# EAGLE design PT_2015_PB_MAIN_Rev2 (EAGLE 7.0.0)
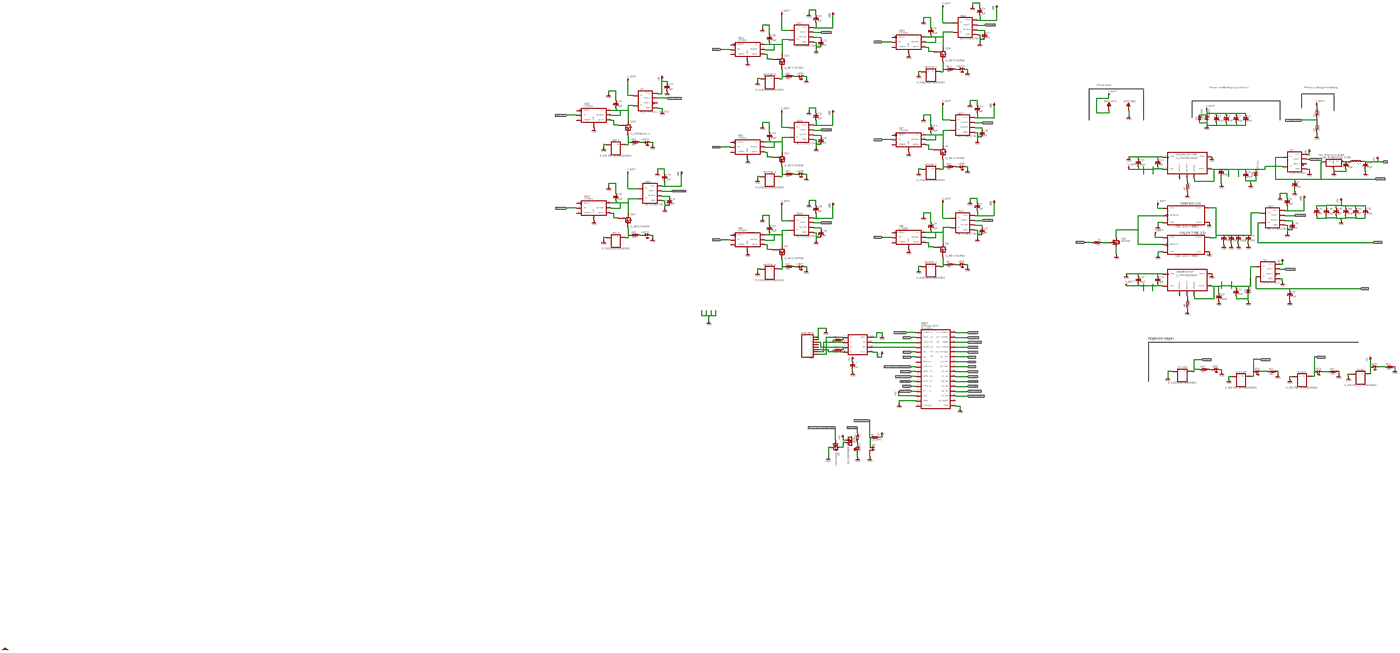
[diagram p0: schematic, sheet 1, overview]
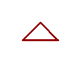
[diagram p1: schematic, sheet 1, part 1 of 5]
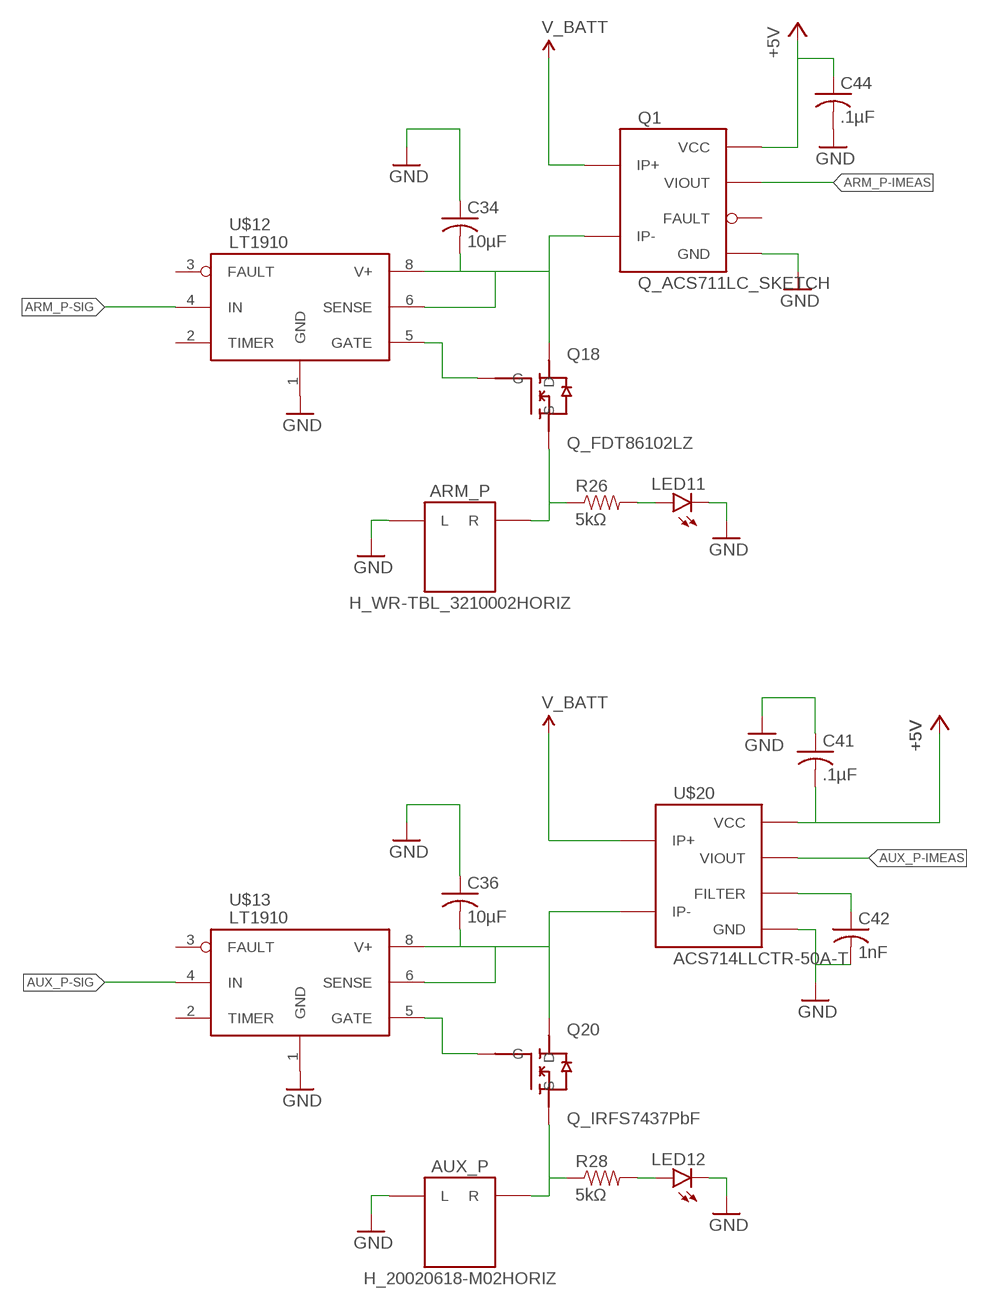
[diagram p2: schematic, sheet 1, part 2 of 5]
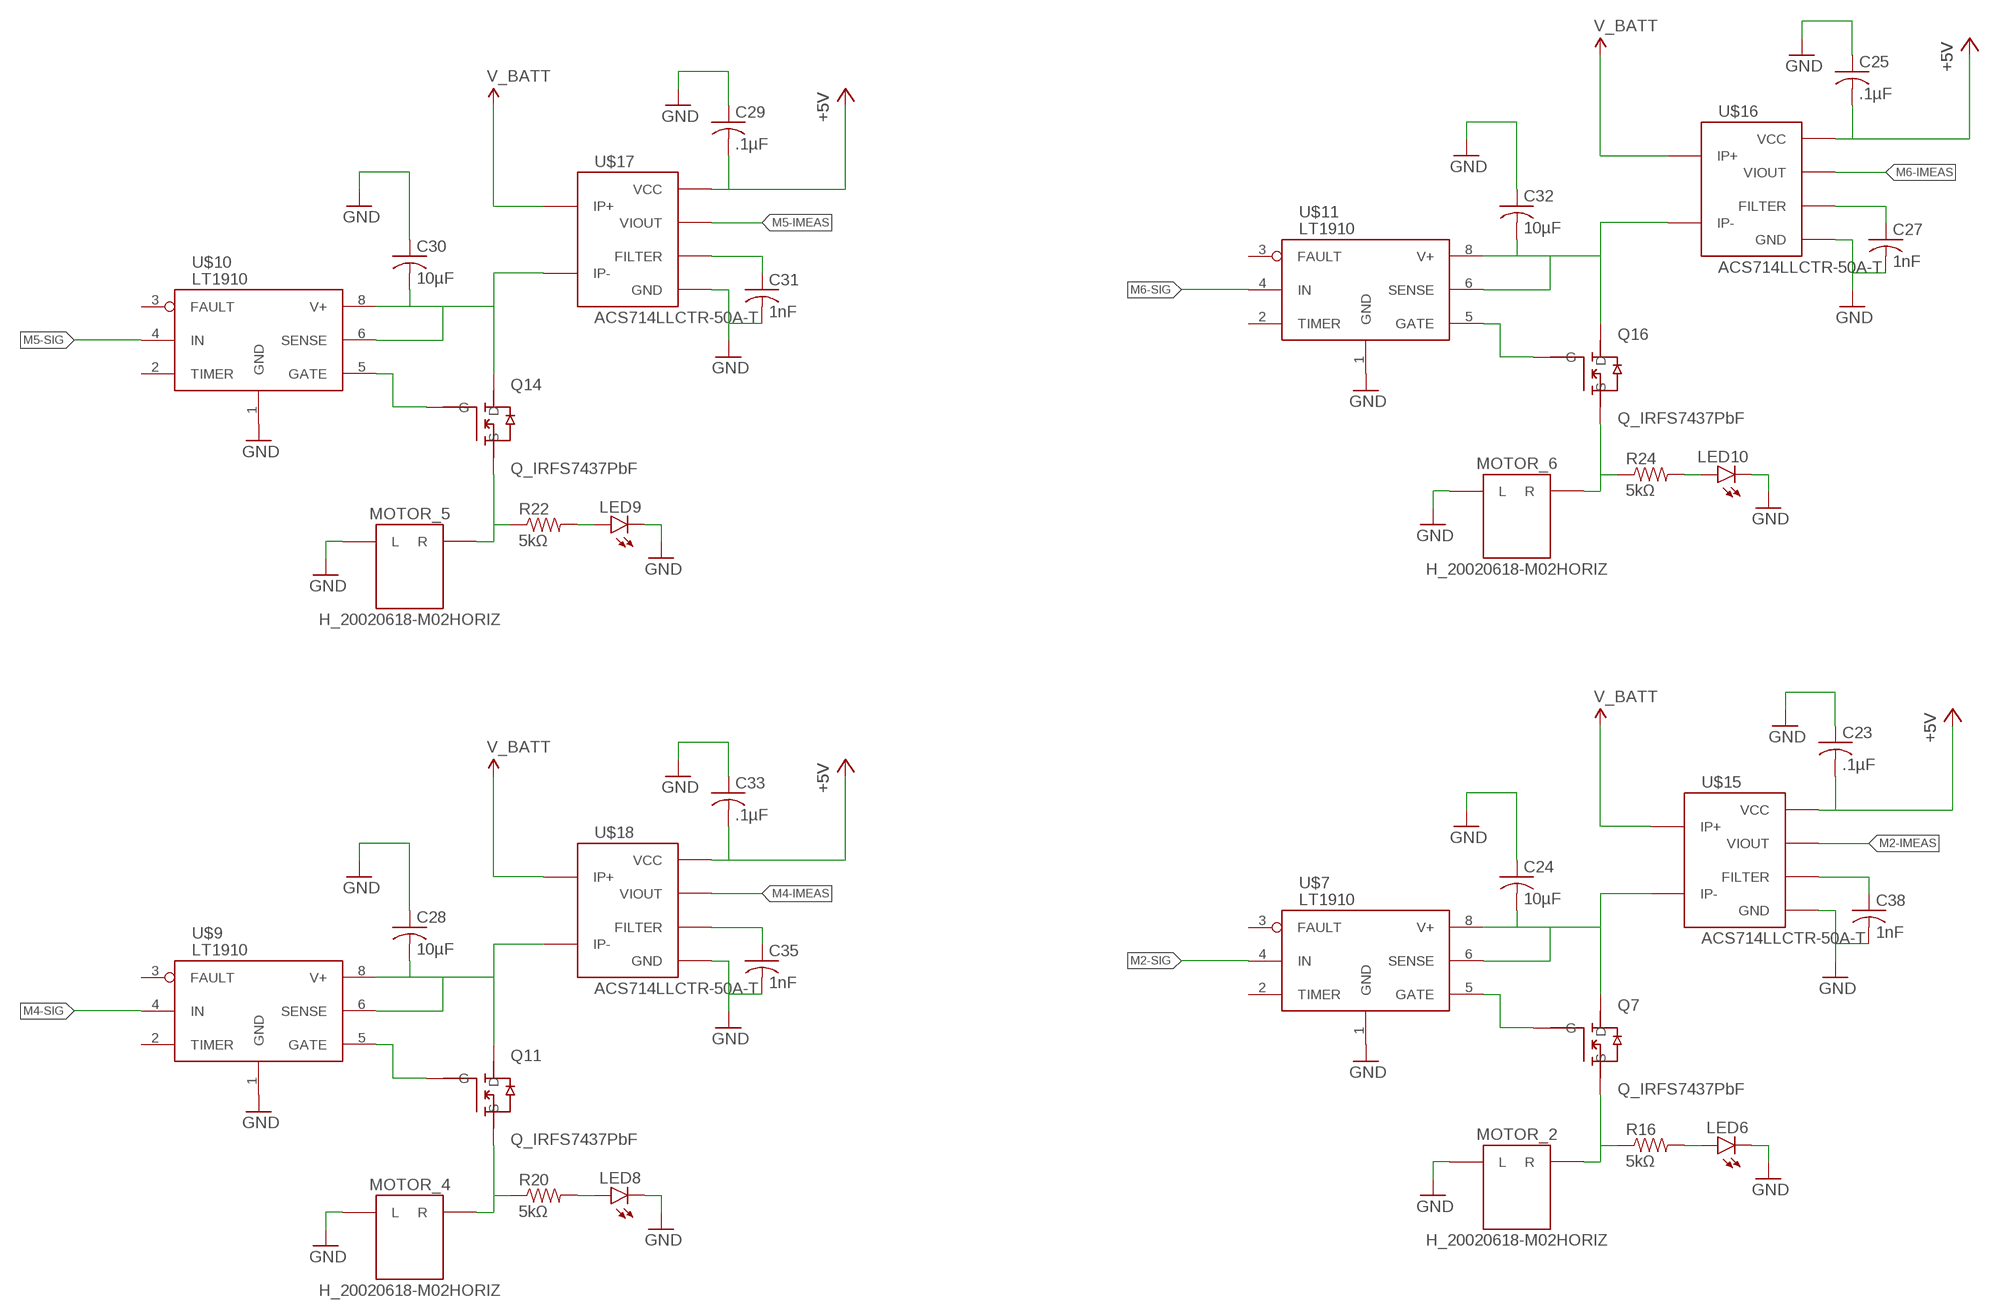
[diagram p3: schematic, sheet 1, part 3 of 5]
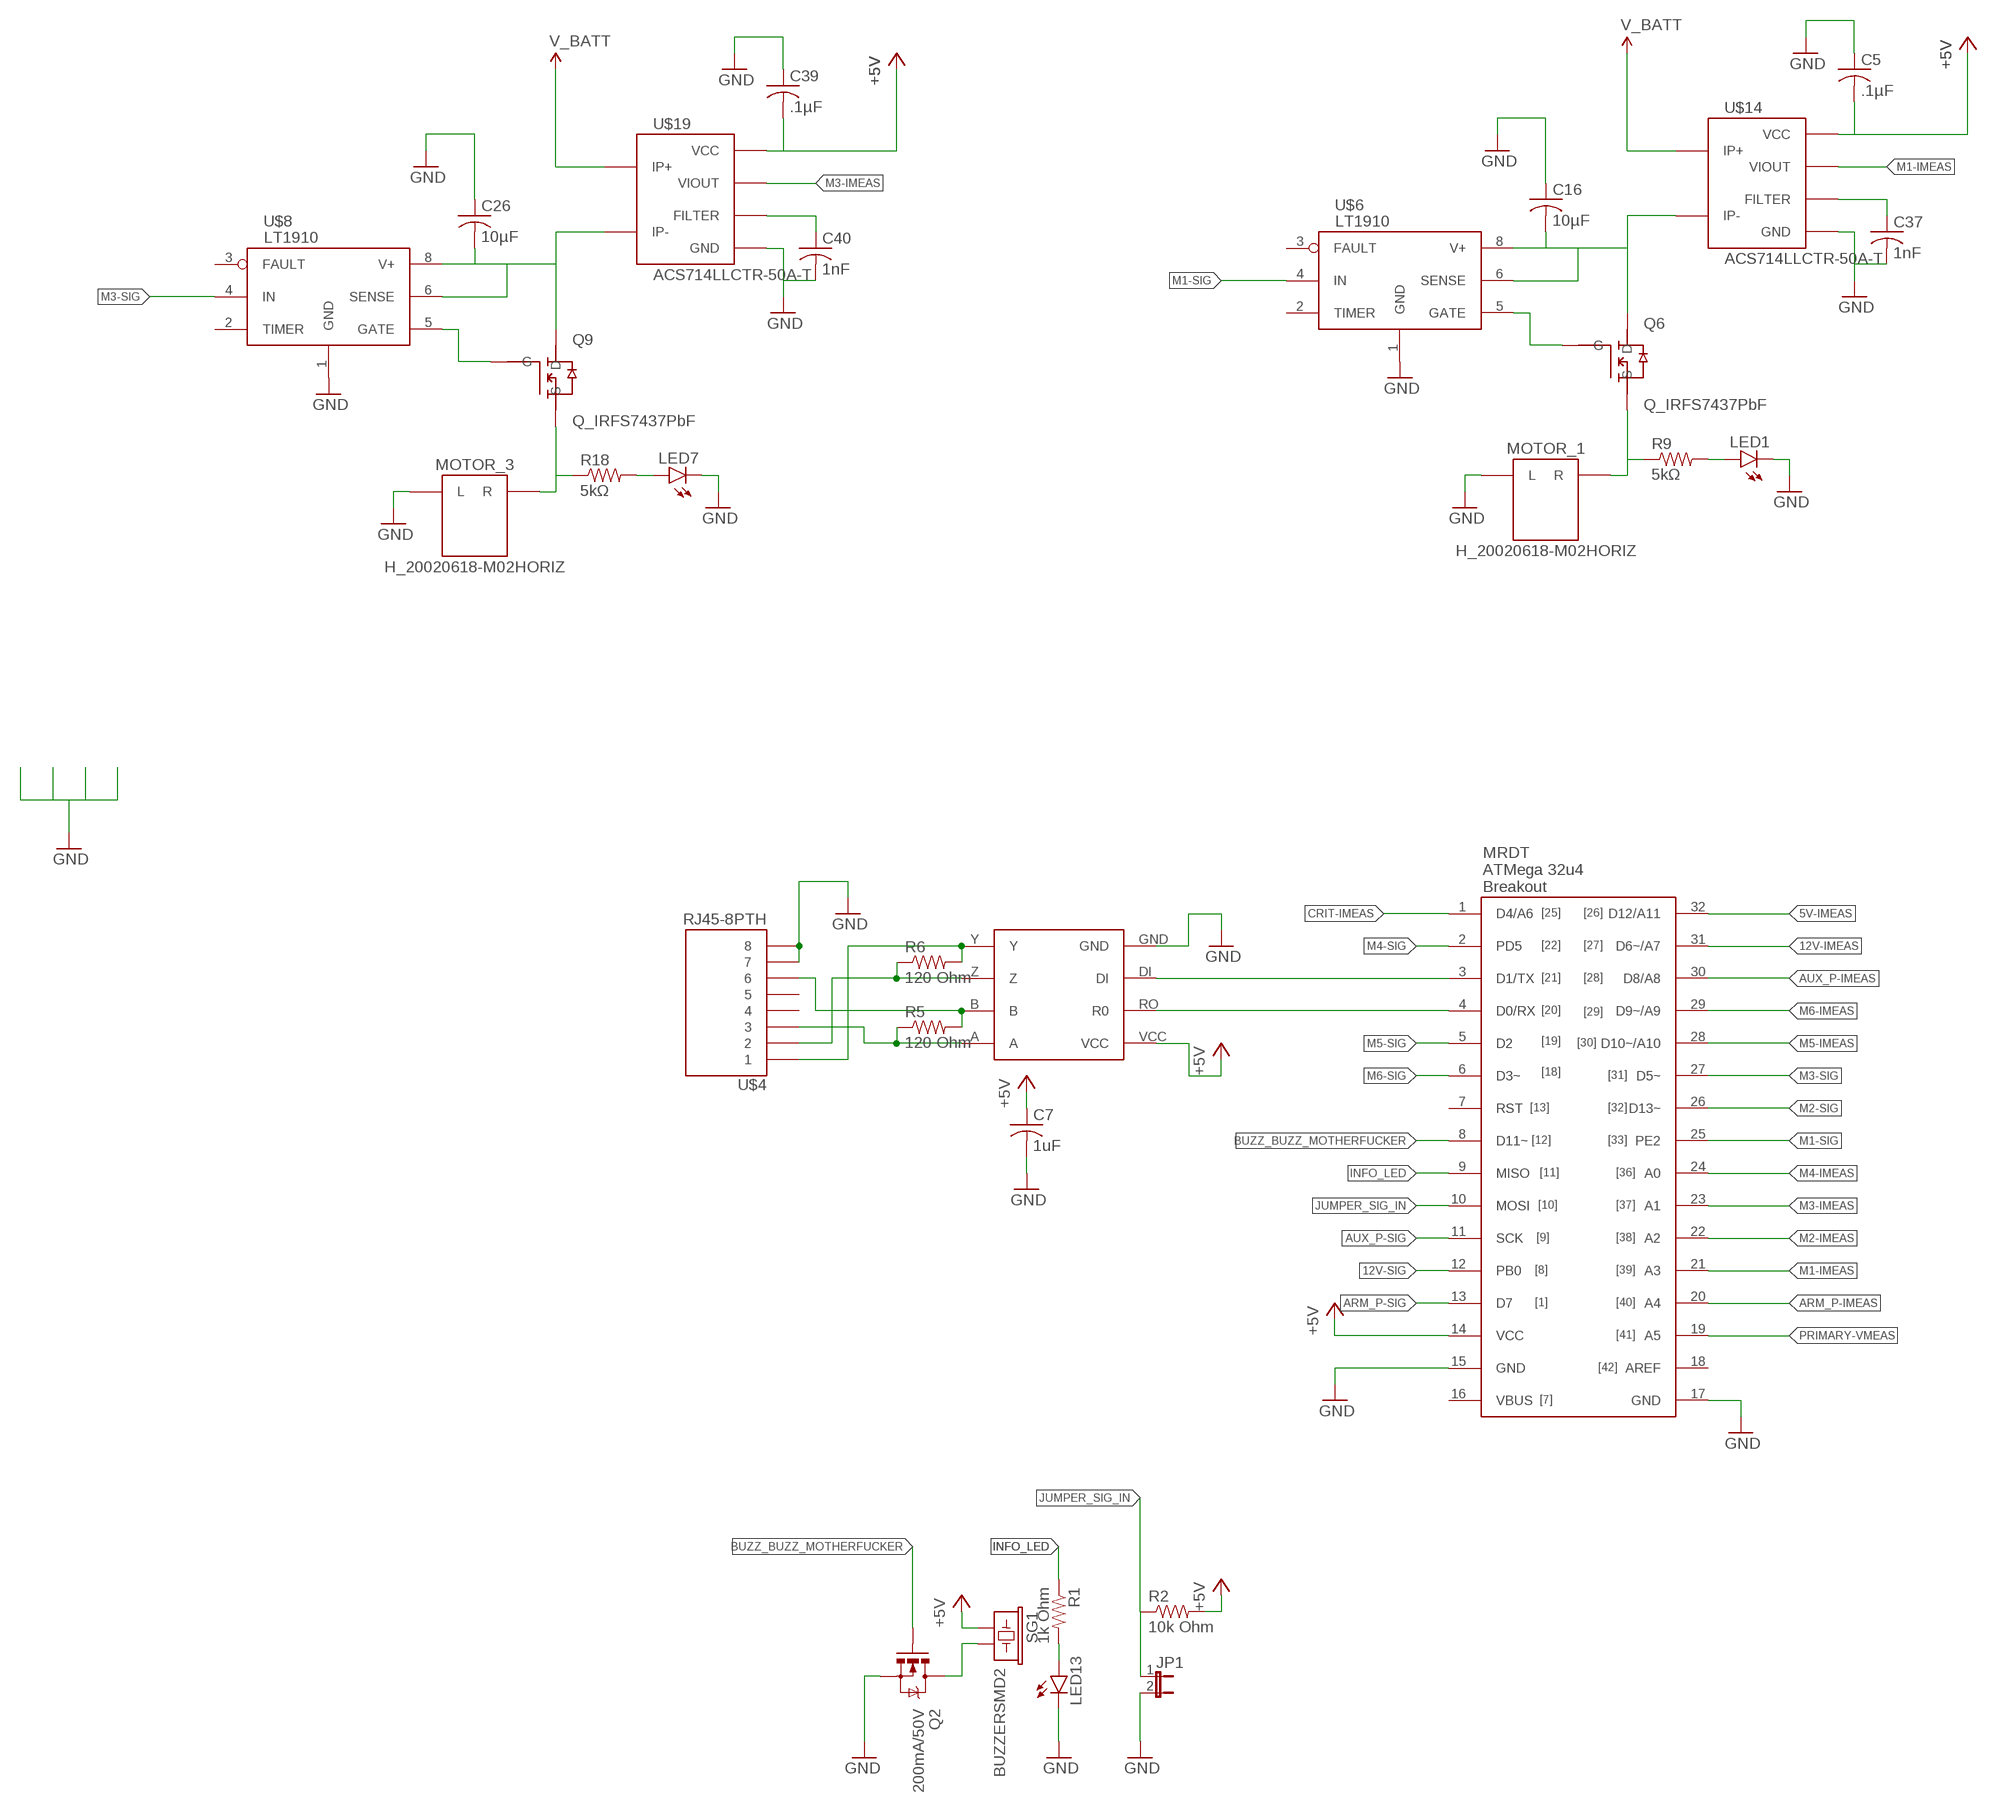
[diagram p4: schematic, sheet 1, part 4 of 5]
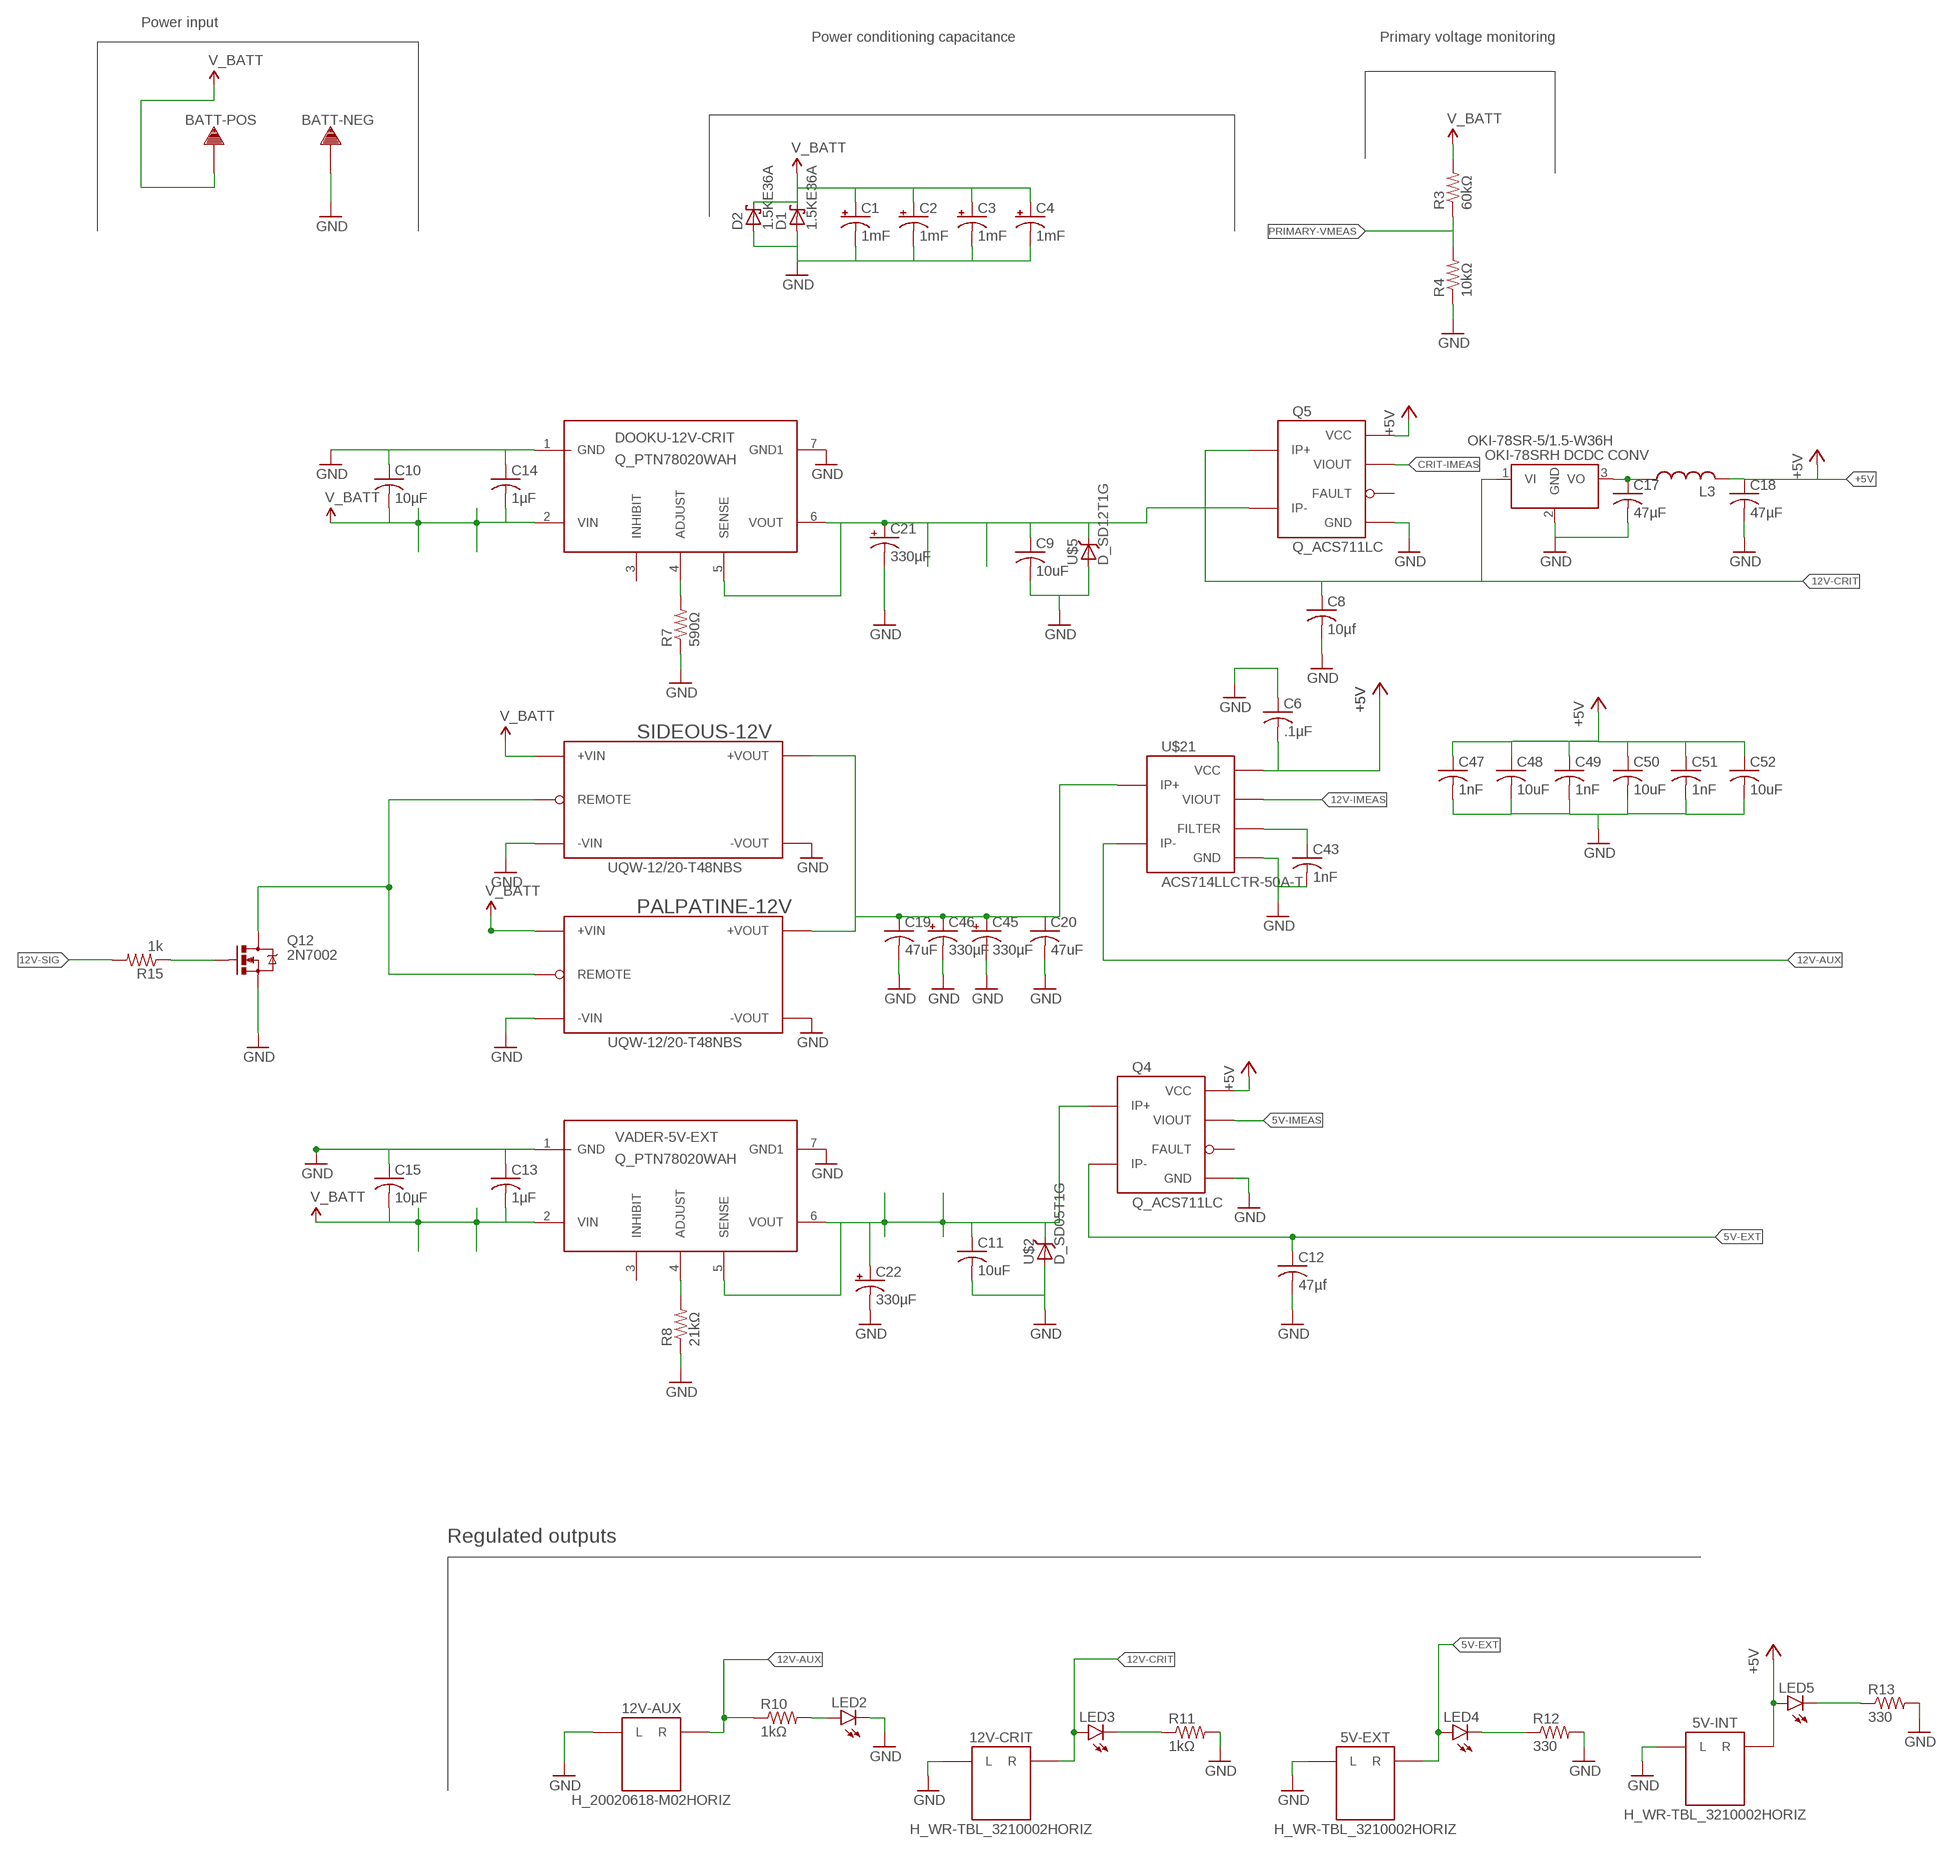
[diagram p5: schematic, sheet 1, part 5 of 5]

## Parts
5V-EXT  H_WR-TBL_3210002HORIZ  [691322110002]
5V-INT  H_WR-TBL_3210002HORIZ  [691322110002]
12V-AUX  H_20020618-M02HORIZ  [20020618-M02]
12V-CRIT  H_WR-TBL_3210002HORIZ  [691322110002]
ARM_P  H_WR-TBL_3210002HORIZ  [691322110002]
AUX_P  H_20020618-M02HORIZ  [20020618-M02]
BATT-NEG  TERMINAL_HOLE  [LARGE_TERMINAL_HOLE]
BATT-POS  TERMINAL_HOLE  [LARGE_TERMINAL_HOLE]
C1  1mF  C_POL12.5MM_NORMAL  [C_12.5MM]
C2  1mF  C_POL12.5MM_NORMAL  [C_12.5MM]
C3  1mF  C_POL12.5MM_NORMAL  [C_12.5MM]
C4  1mF  C_POL12.5MM_NORMAL  [C_12.5MM]
C5  .1µF  C-USC1206  [C1206]
C6  .1µF  C-USC1206  [C1206]
C7  1uF  C-USC1206  [C1206]
C8  10µf  C-USC1206  [C1206]
C9  10uF  C-USC1206  [C1206]
C10  10µF  C-USC1206  [C1206]
C11  10uF  C-USC1206  [C1206]
C12  47µf  C-USC1206  [C1206]
C13  1µF  C-USC1206  [C1206]
C14  1µF  C-USC1206  [C1206]
C15  10µF  C-USC1206  [C1206]
C16  10µF  C-USC1206  [C1206]
C17  47µF  C-USC1206  [C1206]
C18  47µF  C-USC1206  [C1206]
C19  47uF  C-USC1206  [C1206]
C20  47uF  C-USC1206  [C1206]
C21  330µF  CPOL-USE5-8.5  [E5-8,5]
C22  330µF  CPOL-USE5-8.5  [E5-8,5]
C23  .1µF  C-USC1206  [C1206]
C24  10µF  C-USC1206  [C1206]
C25  .1µF  C-USC1206  [C1206]
C26  10µF  C-USC1206  [C1206]
C27  1nF  C-USC1206  [C1206]
C28  10µF  C-USC1206  [C1206]
C29  .1µF  C-USC1206  [C1206]
C30  10µF  C-USC1206  [C1206]
C31  1nF  C-USC1206  [C1206]
C32  10µF  C-USC1206  [C1206]
C33  .1µF  C-USC1206  [C1206]
C34  10µF  C-USC1206  [C1206]
C35  1nF  C-USC1206  [C1206]
C36  10µF  C-USC1206  [C1206]
C37  1nF  C-USC1206  [C1206]
C38  1nF  C-USC1206  [C1206]
C39  .1µF  C-USC1206  [C1206]
C40  1nF  C-USC1206  [C1206]
C41  .1µF  C-USC1206  [C1206]
C42  1nF  C-USC1206  [C1206]
C43  1nF  C-USC1206  [C1206]
C44  .1µF  C-USC1206  [C1206]
C45  330µF  CPOL-USE5-8.5  [E5-8,5]
C46  330µF  CPOL-USE5-8.5  [E5-8,5]
C47  1nF  C-USC1206  [C1206]
C48  10uF  C-USC1206  [C1206]
C49  1nF  C-USC1206  [C1206]
C50  10uF  C-USC1206  [C1206]
C51  1nF  C-USC1206  [C1206]
C52  10uF  C-USC1206  [C1206]
D1  1.5KE36A  15KEXX  [CB429-17]
D2  1.5KE36A  15KEXX  [CB429-17]
DOOKU-12V-CRIT  Q_PTN78020WAH  Q_PTN78020  [R_PDSS-T7]
JP1  JP1E  [JP1]
L3  L-USL8530M  [L8530M]
LED1  LED1206  [LED-1206]
LED2  LED1206  [LED-1206]
LED3  LED1206  [LED-1206]
LED4  LED1206  [LED-1206]
LED5  LED1206  [LED-1206]
LED6  LED1206  [LED-1206]
LED7  LED1206  [LED-1206]
LED8  LED1206  [LED-1206]
LED9  LED1206  [LED-1206]
LED10  LED1206  [LED-1206]
LED11  LED1206  [LED-1206]
LED12  LED1206  [LED-1206]
LED13  LED-FKIT-1206  [FKIT-LED-1206]
MOTOR_1  H_20020618-M02HORIZ  [20020618-M02]
MOTOR_2  H_20020618-M02HORIZ  [20020618-M02]
MOTOR_3  H_20020618-M02HORIZ  [20020618-M02]
MOTOR_4  H_20020618-M02HORIZ  [20020618-M02]
MOTOR_5  H_20020618-M02HORIZ  [20020618-M02]
MOTOR_6  H_20020618-M02HORIZ  [20020618-M02]
OKI-78SR-5/1.5-W36H  Q_OKI-78SR  [OKI-78SRH]
PALPATINE-12V  UQW-12/20-T48NBS  [U-T48-QB-NO_TRIM]
Q1  Q_ACS711LC_SKETCH  [SOIC8_ACS711_SKETCH]
Q2  200mA/50V  MOSFET-NCHANNELBSS138  [SOT23-3]
Q4  Q_ACS711LC  [SOIC8_ACS711]
Q5  Q_ACS711LC  [SOIC8_ACS711]
Q6  Q_IRFS7437PbF  Q_IRF7437SMD  [D2PACK]
Q7  Q_IRFS7437PbF  Q_IRF7437SMD  [D2PACK]
Q9  Q_IRFS7437PbF  Q_IRF7437SMD  [D2PACK]
Q11  Q_IRFS7437PbF  Q_IRF7437SMD  [D2PACK]
Q12  2N7002  MOSFET-NCHANNEL2N7002PW  [SOT323]
Q14  Q_IRFS7437PbF  Q_IRF7437SMD  [D2PACK]
Q16  Q_IRFS7437PbF  Q_IRF7437SMD  [D2PACK]
Q18  Q_FDT86102LZ  [SOT-223]
Q20  Q_IRFS7437PbF  Q_IRF7437SMD  [D2PACK]
R1  1k Ohm  RESISTOR1206  [1206]
R2  10k Ohm  RESISTOR1206  [1206]
R3  60kΩ  R-US_R1206  [R1206]
R4  10kΩ  R-US_R1206  [R1206]
R5  120 Ohm  RESISTOR1206  [1206]
R6  120 Ohm  RESISTOR1206  [1206]
R7  590Ω  R-US_R1206  [R1206]
R8  21kΩ  R-US_R1206  [R1206]
R9  5kΩ  RESISTOR1206  [1206]
R10  1kΩ  RESISTOR1206  [1206]
R11  1kΩ  RESISTOR1206  [1206]
R12  330  RESISTOR1206  [1206]
R13  330  RESISTOR1206  [1206]
R15  1k  R-US_R1206  [R1206]
R16  5kΩ  RESISTOR1206  [1206]
R18  5kΩ  RESISTOR1206  [1206]
R20  5kΩ  RESISTOR1206  [1206]
R22  5kΩ  RESISTOR1206  [1206]
R24  5kΩ  RESISTOR1206  [1206]
R26  5kΩ  RESISTOR1206  [1206]
R28  5kΩ  RESISTOR1206  [1206]
SG1  BUZZERSMD2  [BUZZER-CCV]
SIDEOUS-12V  UQW-12/20-T48NBS  [U-T48-QB-NO_TRIM]
U$1  32U4_BREAKOUT  [32U4_MCU_DIP]
U$2  D_SD05T1G  D_SD12T1G  [SOD-323]
U$3  MAX3077  [MAX3070E]
U$4  RJ45-8PTH  [RJ45-8]
U$5  D_SD12T1G  [SOD-323]
U$6  LT1910  [SO8]
U$7  LT1910  [SO8]
U$8  LT1910  [SO8]
U$9  LT1910  [SO8]
U$10  LT1910  [SO8]
U$11  LT1910  [SO8]
U$12  LT1910  [SO8]
U$13  LT1910  [SO8]
U$14  ACS714LLCTR-50A-T  Q_ACS714_SKETCH  [SOIC8_ACS711_SKETCH]
U$15  ACS714LLCTR-50A-T  Q_ACS714_SKETCH  [SOIC8_ACS711_SKETCH]
U$16  ACS714LLCTR-50A-T  Q_ACS714_SKETCH  [SOIC8_ACS711_SKETCH]
U$17  ACS714LLCTR-50A-T  Q_ACS714_SKETCH  [SOIC8_ACS711_SKETCH]
U$18  ACS714LLCTR-50A-T  Q_ACS714_SKETCH  [SOIC8_ACS711_SKETCH]
U$19  ACS714LLCTR-50A-T  Q_ACS714_SKETCH  [SOIC8_ACS711_SKETCH]
U$20  ACS714LLCTR-50A-T  Q_ACS714_SKETCH  [SOIC8_ACS711_SKETCH]
U$21  ACS714LLCTR-50A-T  Q_ACS714  [SOIC8_ACS711]
U$22  TEST  [TEST]
VADER-5V-EXT  Q_PTN78020WAH  Q_PTN78020  [R_PDSS-T7]

## Nets
5V-EXT: 5V-EXT.R C12.1 LED4.A Q4.4(IP-)
5V-IMEAS: Q4.7(VIOUT) U$1.32(D12/A11)
12V-AUX: 12V-AUX.R1(R) 12V-AUX.R2(R) R10.1 U$21.4(IP-)
12V-CRIT: 12V-CRIT.R C8.1 LED3.A OKI-78SR-5/1.5-W36H.1(VI) Q5.1(IP+)
12V-IMEAS: U$1.31(D6~/A7) U$21.7(VIOUT)
12V-SIG: R15.2 U$1.12(PB0)
+5V: 5V-INT.R C5.2 C6.2 C7.1 C18.1 C23.2 C25.2 C29.2 C33.2 C39.2 C41.2 C44.1 C47.1 C48.1 C49.1 C50.1 C51.1 C52.1 L3.2 LED5.A Q1.8(VCC) Q4.8(VCC) Q5.8(VCC) R2.2 SG1.+ U$1.14(VCC) U$3.VCC U$14.8(VCC) U$15.8(VCC) U$16.8(VCC) U$17.8(VCC) U$18.8(VCC) U$19.8(VCC) U$20.8(VCC) U$21.8(VCC)
ARM_P-IMEAS: Q1.7(VIOUT) U$1.20(A4)
ARM_P-SIG: U$1.13(D7) U$12.4(IN)
AUX_P-IMEAS: U$1.30(D8/A8) U$20.7(VIOUT)
AUX_P-SIG: U$1.11(SCK) U$13.4(IN)
BUZZ_BUZZ_MOTHERFUCKER: Q2.1(G) U$1.8(D11~)
CRIT-IMEAS: Q5.7(VIOUT) U$1.1(D4/A6)
GND: 5V-EXT.L 5V-INT.L 12V-AUX.L1(L) 12V-AUX.L2(L) 12V-CRIT.L ARM_P.L AUX_P.L1(L) AUX_P.L2(L) BATT-NEG.P$1 C1.- C2.- C3.- C4.- C5.1 C6.1 C7.2 C8.2 C9.2 C10.1 C11.2 C12.2 C13.1 C14.1 C15.1 C16.1 C17.2 C18.2 C19.2 C20.2 C21.- C22.- C23.1 C24.1 C25.1 C26.1 C27.2 C28.1 C29.1 C30.1 C31.2 C32.1 C33.1 C34.1 C35.2 C36.1 C37.2 C38.2 C39.1 C40.2 C41.1 C42.2 C43.2 C44.2 C45.- C46.- C47.2 C48.2 C49.2 C50.2 C51.2 C52.2 D1.A D2.A DOOKU-12V-CRIT.1(GND) DOOKU-12V-CRIT.7(GND1) JP1.2 LED1.C LED2.C LED6.C LED7.C LED8.C LED9.C LED10.C LED11.C LED12.C LED13.C MOTOR_1.L1(L) MOTOR_1.L2(L) MOTOR_2.L1(L) MOTOR_2.L2(L) MOTOR_3.L1(L) MOTOR_3.L2(L) MOTOR_4.L1(L) MOTOR_4.L2(L) MOTOR_5.L1(L) MOTOR_5.L2(L) MOTOR_6.L1(L) MOTOR_6.L2(L) OKI-78SR-5/1.5-W36H.2(GND) PALPATINE-12V.3(-VIN) PALPATINE-12V.4(-VOUT) Q1.5(GND) Q2.2(S) Q4.5(GND) Q5.5(GND) Q12.2(S) R4.1 R7.1 R8.1 R11.2 R12.2 R13.2 SIDEOUS-12V.3(-VIN) SIDEOUS-12V.4(-VOUT) U$1.15(GND) U$1.17(GND) U$2.2(A) U$3.GND U$4.7 U$4.8 U$5.2(A) U$6.1(GND) U$7.1(GND) U$8.1(GND) U$9.1(GND) U$10.1(GND) U$11.1(GND) U$12.1(GND) U$13.1(GND) U$14.5(GND) U$15.5(GND) U$16.5(GND) U$17.5(GND) U$18.5(GND) U$19.5(GND) U$20.5(GND) U$21.5(GND) VADER-5V-EXT.1(GND) VADER-5V-EXT.7(GND1)
INFO_LED: R1.1 U$1.9(MISO)
JUMPER_SIG_IN: JP1.1 R2.1 U$1.10(MOSI)
M1-IMEAS: U$1.21(A3) U$14.7(VIOUT)
M1-SIG: U$1.25(PE2) U$6.4(IN)
M2-IMEAS: U$1.22(A2) U$15.7(VIOUT)
M2-SIG: U$1.26(D13~) U$7.4(IN)
M3-IMEAS: U$1.23(A1) U$19.7(VIOUT)
M3-SIG: U$1.27(D5~) U$8.4(IN)
M4-IMEAS: U$1.24(A0) U$18.7(VIOUT)
M4-SIG: U$1.2(PD5) U$9.4(IN)
M5-IMEAS: U$1.28(D10~/A10) U$17.7(VIOUT)
M5-SIG: U$1.5(D2) U$10.4(IN)
M6-IMEAS: U$1.29(D9~/A9) U$16.7(VIOUT)
M6-SIG: U$1.6(D3~) U$11.4(IN)
N$1: C37.1 U$14.6(FILTER)
N$2: C38.1 U$15.6(FILTER)
N$3: LED3.C R11.1
N$4: PALPATINE-12V.2(REMOTE) Q12.3(D) SIDEOUS-12V.2(REMOTE)
N$5: LED4.C R12.1
N$6: LED5.C R13.1
N$7: C19.1 C20.1 C45.+ C46.+ PALPATINE-12V.8(+VOUT) SIDEOUS-12V.8(+VOUT) U$21.1(IP+)
N$8: Q2.3(D) SG1.-
N$9: DOOKU-12V-CRIT.4(ADJUST) R7.2
N$11: LED13.A R1.2
N$12: C43.1 U$21.6(FILTER)
N$14: R6.2 U$3.Y U$4.1
N$16: C11.1 C22.+ Q4.1(IP+) U$2.1(C) VADER-5V-EXT.5(SENSE) VADER-5V-EXT.6(VOUT)
N$17: C27.1 U$16.6(FILTER)
N$18: R6.1 U$3.Z U$4.2
N$19: R5.2 U$3.B U$4.6
N$20: R5.1 U$3.A U$4.3
N$21: U$1.3(D1/TX) U$3.DI
N$22: C31.1 U$17.6(FILTER)
N$23: C35.1 U$18.6(FILTER)
N$24: C40.1 U$19.6(FILTER)
N$25: C42.1 U$20.6(FILTER)
N$28: C24.2 Q7.TAB(D) U$7.6(SENSE) U$7.8(V+) U$15.4(IP-)
N$29: MOTOR_2.R1(R) MOTOR_2.R2(R) Q7.2(S) R16.1
N$30: Q7.1(G) U$7.5(GATE)
N$31: LED6.A R16.2
N$35: R8.2 VADER-5V-EXT.4(ADJUST)
N$36: C9.1 C21.+ DOOKU-12V-CRIT.5(SENSE) DOOKU-12V-CRIT.6(VOUT) Q5.4(IP-) U$5.1(C)
N$39: LED1.A R9.2
N$40: C16.2 Q6.TAB(D) U$6.6(SENSE) U$6.8(V+) U$14.4(IP-)
N$41: MOTOR_1.R1(R) MOTOR_1.R2(R) Q6.2(S) R9.1
N$42: Q6.1(G) U$6.5(GATE)
N$44: C26.2 Q9.TAB(D) U$8.6(SENSE) U$8.8(V+) U$19.4(IP-)
N$45: MOTOR_3.R1(R) MOTOR_3.R2(R) Q9.2(S) R18.1
N$46: LED2.A R10.2
N$47: Q9.1(G) U$8.5(GATE)
N$49: LED7.A R18.2
N$54: C28.2 Q11.TAB(D) U$9.6(SENSE) U$9.8(V+) U$18.4(IP-)
N$55: MOTOR_4.R1(R) MOTOR_4.R2(R) Q11.2(S) R20.1
N$56: Q11.1(G) U$9.5(GATE)
N$57: LED8.A R20.2
N$60: C30.2 Q14.TAB(D) U$10.6(SENSE) U$10.8(V+) U$17.4(IP-)
N$61: MOTOR_5.R1(R) MOTOR_5.R2(R) Q14.2(S) R22.1
N$62: Q14.1(G) U$10.5(GATE)
N$63: LED9.A R22.2
N$66: C32.2 Q16.TAB(D) U$11.6(SENSE) U$11.8(V+) U$16.4(IP-)
N$67: MOTOR_6.R1(R) MOTOR_6.R2(R) Q16.2(S) R24.1
N$68: Q16.1(G) U$11.5(GATE)
N$69: LED10.A R24.2
N$72: C34.2 Q1.4(IP-) Q18.2(D) Q18.4(D) U$12.6(SENSE) U$12.8(V+)
N$73: ARM_P.R Q18.3(S) R26.1
N$74: Q18.1(G) U$12.5(GATE)
N$75: LED11.A R26.2
N$78: C36.2 Q20.TAB(D) U$13.6(SENSE) U$13.8(V+) U$20.4(IP-)
N$79: AUX_P.R1(R) AUX_P.R2(R) Q20.2(S) R28.1
N$80: Q20.1(G) U$13.5(GATE)
N$81: LED12.A R28.2
N$100: C17.1 L3.1 OKI-78SR-5/1.5-W36H.3(VO)
N$114: Q12.1(G) R15.1
PRIMARY-VMEAS: R3.1 R4.2 U$1.19(A5)
RXD: U$1.4(D0/RX) U$3.RO(R0)
V_BATT: BATT-POS.P$1 C1.+ C2.+ C3.+ C4.+ C10.2 C13.2 C14.2 C15.2 D1.C D2.C DOOKU-12V-CRIT.2(VIN) PALPATINE-12V.1(+VIN) Q1.1(IP+) R3.2 SIDEOUS-12V.1(+VIN) U$14.1(IP+) U$15.1(IP+) U$16.1(IP+) U$17.1(IP+) U$18.1(IP+) U$19.1(IP+) U$20.1(IP+) VADER-5V-EXT.2(VIN)
Unconnected: DOOKU-12V-CRIT.3(INHIBIT) Q1.6(FAULT) Q4.6(FAULT) Q5.6(FAULT) U$1.7(RST) U$1.16(VBUS) U$1.18(AREF) U$4.4 U$4.5 U$6.2(TIMER) U$6.3(FAULT) U$7.2(TIMER) U$7.3(FAULT) U$8.2(TIMER) U$8.3(FAULT) U$9.2(TIMER) U$9.3(FAULT) U$10.2(TIMER) U$10.3(FAULT) U$11.2(TIMER) U$11.3(FAULT) U$12.2(TIMER) U$12.3(FAULT) U$13.2(TIMER) U$13.3(FAULT) VADER-5V-EXT.3(INHIBIT)

## Notes on the sheet
- Power input
- Power conditioning capacitance | Primary voltage monitoring
- Regulated outputs

## Library data of the parts
5V-EXT 5V-INT 12V-CRIT ARM_P = MRDT-2015-PowerBoard:H_WR-TBL_32*1*0002: Wurth Electronic's 2-pin 10A pluggable screw terminal headers. Vertical and Horizantal Part Numbers: 691322110002 (Horizantal) 691321100002 (Vertical); DIGIKEY_PN: 732-2769-ND
12V-AUX AUX_P MOTOR_1-MOTOR_6 = MRDT-2015-PowerBoard:H_20020618-M02*: High amp pluggable screw terminal from FCI. Rated up to 32A Horizantal variant is 20020618-M02* Vertical variant is 20020620-M02*; DIGIKEY_PN: 609-3951-ND
BATT-NEG BATT-POS = MRDT-2015-PowerBoard:TERMINAL_HOLE
C1-C4 = MRDT-2014-All:C_POL: Alum Elect. Cap with 10mm diameter, 5mm lead spacing and 0.7mm lead diameter
C5-C20 C23-C44 C47-C52 = resistor:C-US: CAPACITOR, American symbol
C21 C22 C45 C46 = resistor:CPOL-US: POLARIZED CAPACITOR, American symbol
D1 D2 = diode:15KEXX: DIODE
DOOKU-12V-CRIT VADER-5V-EXT = MRDT-2015-PowerBoard:Q_PTN78020: TI DC/DC converter 36Vin - Adjustable output
JP1 = jumper:JP1E: JUMPER
L3 = resistor:L-US: INDUCTOR, American symbol
LED1-LED13 = SparkFun-LED:LED: LEDs Standard schematic elements and footprints for 5mm, 3mm, 1206, and 0603 sized LEDs. 5mm - Spark Fun Electronics SKU : COM-00529 (and others)
OKI-78SR-5/1.5-W36H = MRDT-2015-PowerBoard:Q_OKI-78SR: 4.95W DC/DC Converter Manufacturer: Murata Part Number: OKI-78SR-5/1.5-W36H-C OKI-78SR-3.3/1.5-W36H-C
PALPATINE-12V SIDEOUS-12V = MRDT-2015-PowerBoard:UQW-12/20-T48NBS
Q1 Q4 Q5 = MRDT-2015-PowerBoard:Q_ACS711*LC: ±12.5A or ±25A Hall-effect current transducer. SOIC-8 Package with fused pads.
Q2 = SparkFun-DiscreteSemi:MOSFET-NCHANNEL: Common NMOSFET Parts MFG P/N Store ID Prod ID FDD8780 TRANS-09984 SI7820DN TRANS-11055 FDS6630A IC-08089 2N7002PW TRANS-11151 FQP30N06L COM-10213 TRANS-10060 BSS123LT1G TRANS-08345 BSS138 TRANS-00830 BS170 2N7000; PROD_ID: TRANS-00830
Q6 Q7 Q9 Q11 Q14 Q16 Q20 = MRDT-2015-PowerBoard:Q_IRF*7437: 40V 195A N-CH MOSFET switch with heatsink
Q12 = SparkFun-DiscreteSemi:MOSFET-NCHANNEL: Common NMOSFET Parts MFG P/N Store ID Prod ID FDD8780 TRANS-09984 SI7820DN TRANS-11055 FDS6630A IC-08089 2N7002PW TRANS-11151 FQP30N06L COM-10213 TRANS-10060 BSS123LT1G TRANS-08345 BSS138 TRANS-00830 BS170 2N7000; PROD_ID: TRANS-11151
Q18 = MRDT-2015-PowerBoard:Q_FDT86102LZ
R1 R2 R5 R6 R9-R13 R16 R18 R20 R22 R24 R26 R28 = SparkFun-Passives:RESISTOR: Resistor Basic schematic elements and footprints for 0603, 1206, and PTH resistors.
R3 R4 R7 R8 R15 = resistor:R-US_: RESISTOR, American symbol
SG1 = SparkFun-Electromechanical:BUZZER: Buzzer 12mm Spark Fun Electronics SKU : Comp-Buzzer
U$1 = MRDT-2015-General:32U4_BREAKOUT
U$2 U$5 = MRDT-2014-All:D_SD12T1G: 12V or 5V Zener
U$3 = MAX3077:MAX3077
U$4 = SparkFun-Connectors:RJ45-8: RJ45 Jack Simple RJ45, 8-pin connection - connector for common Cat5, Cat5e, and Cat6 Ethernet cables. Footprint not yet proven in production. Connector sku is PRT-00643; Breakout PCB sku is BOB-00716.
U$6-U$13 = Jake:LT1910
U$14-U$21 = MRDT-2015-PowerBoard:Q_ACS714: Sketch variant has increased clearance for traces.
U$22 = MRDT-2015-General:TEST

## Board
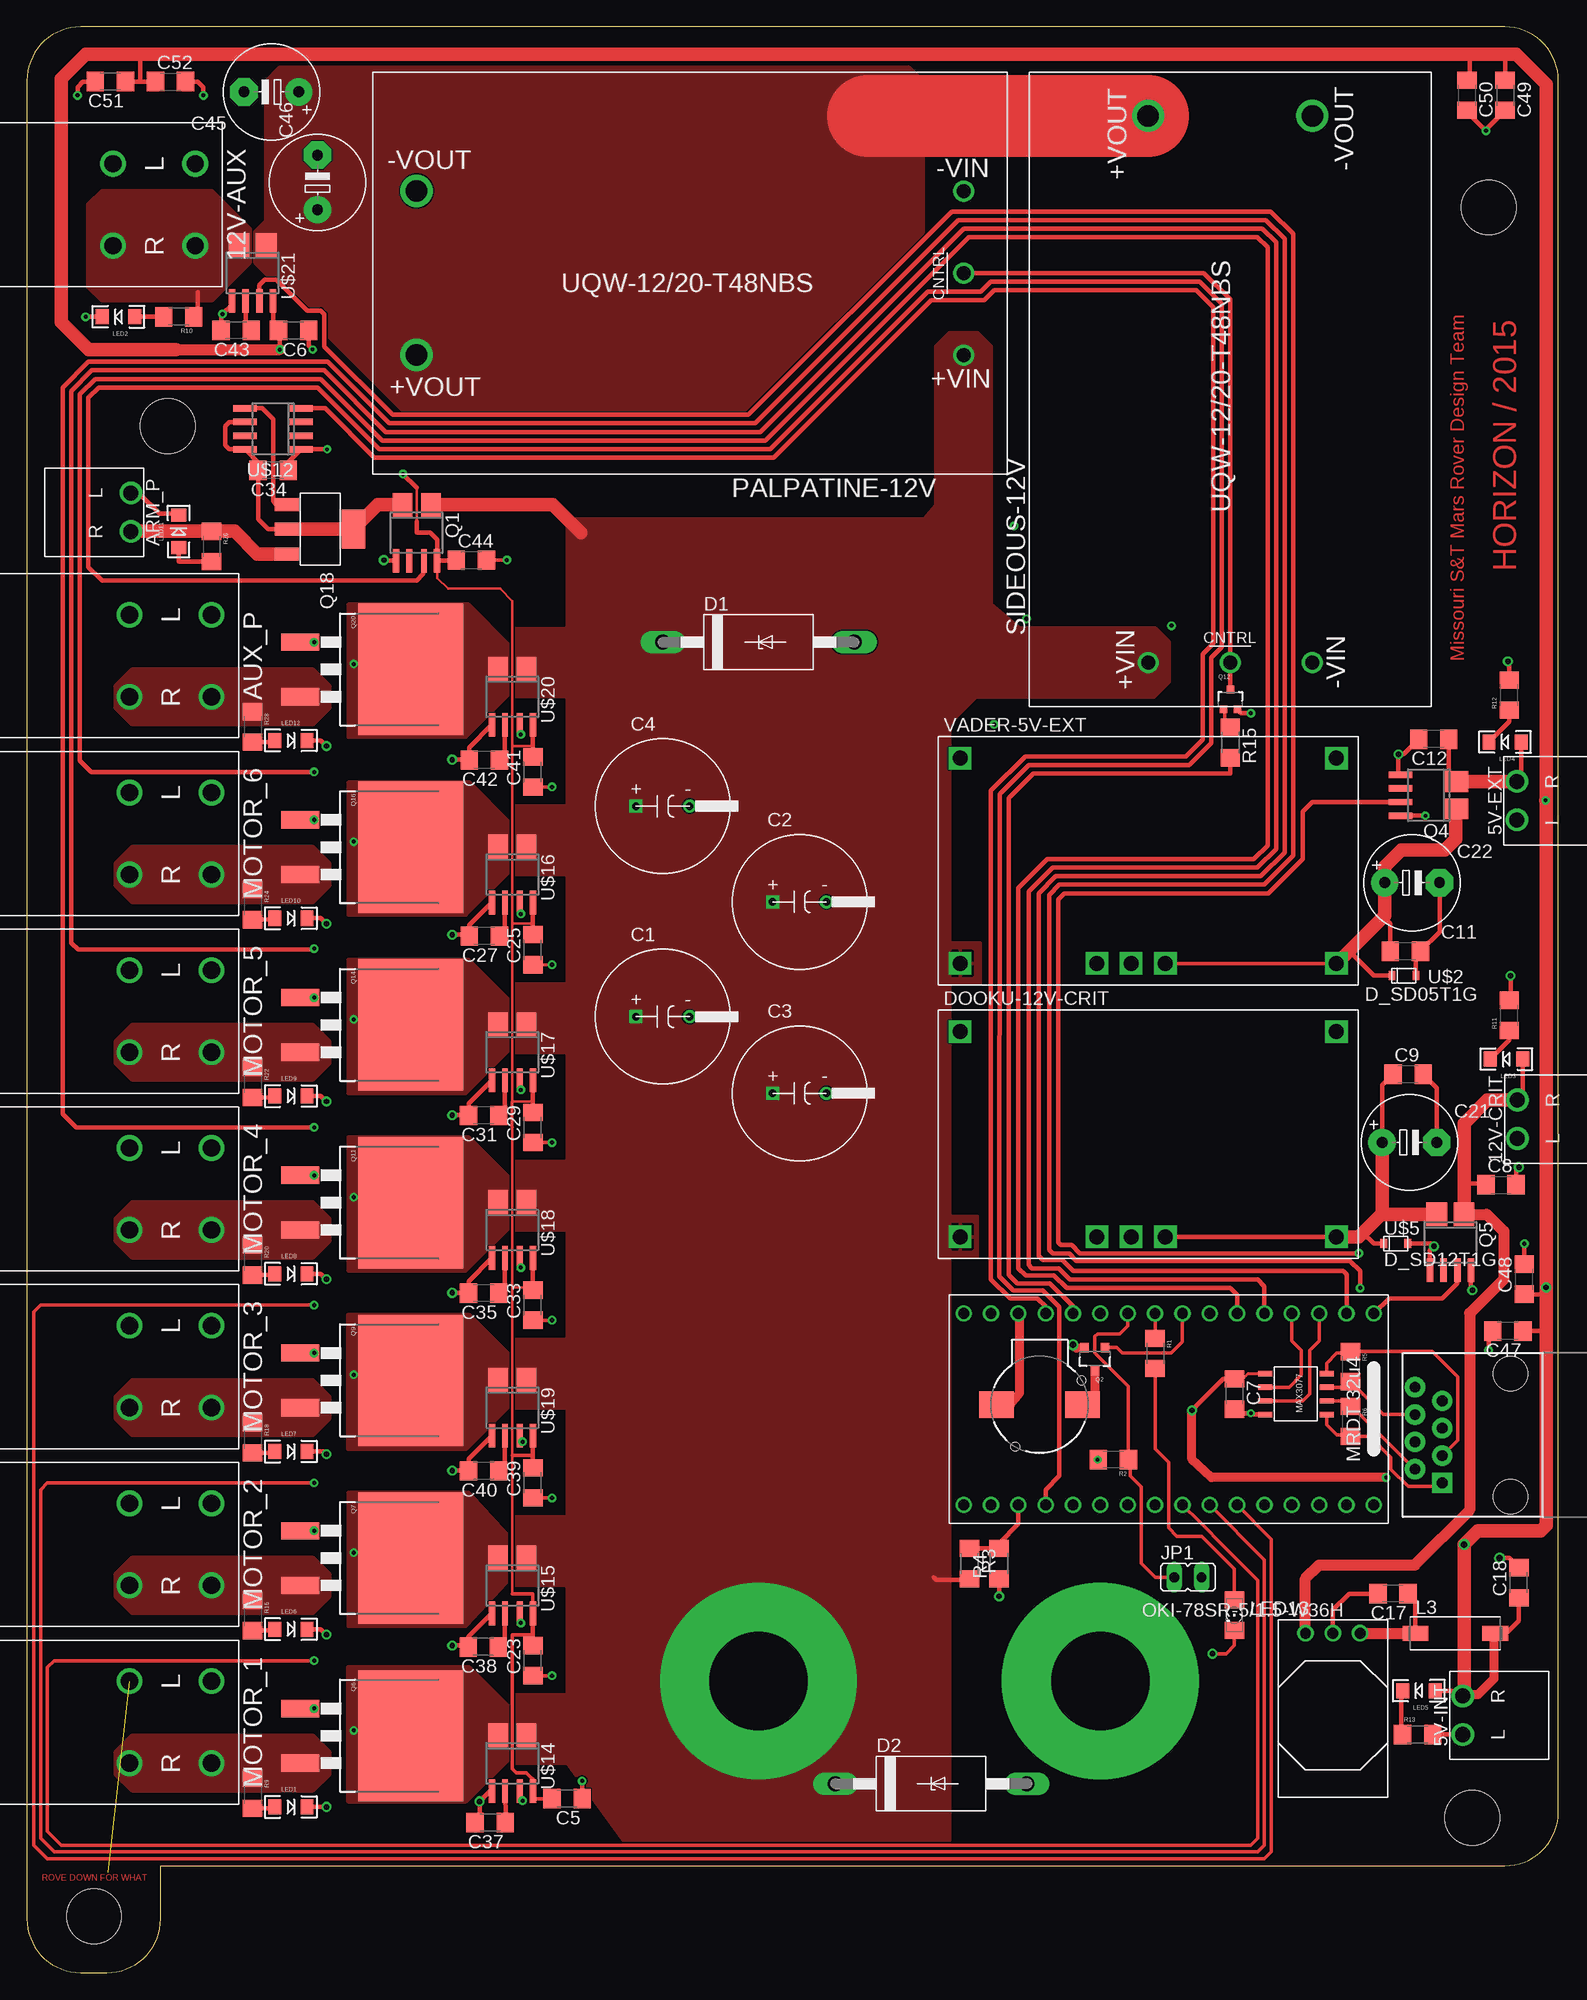
[diagram p6: board, top side]
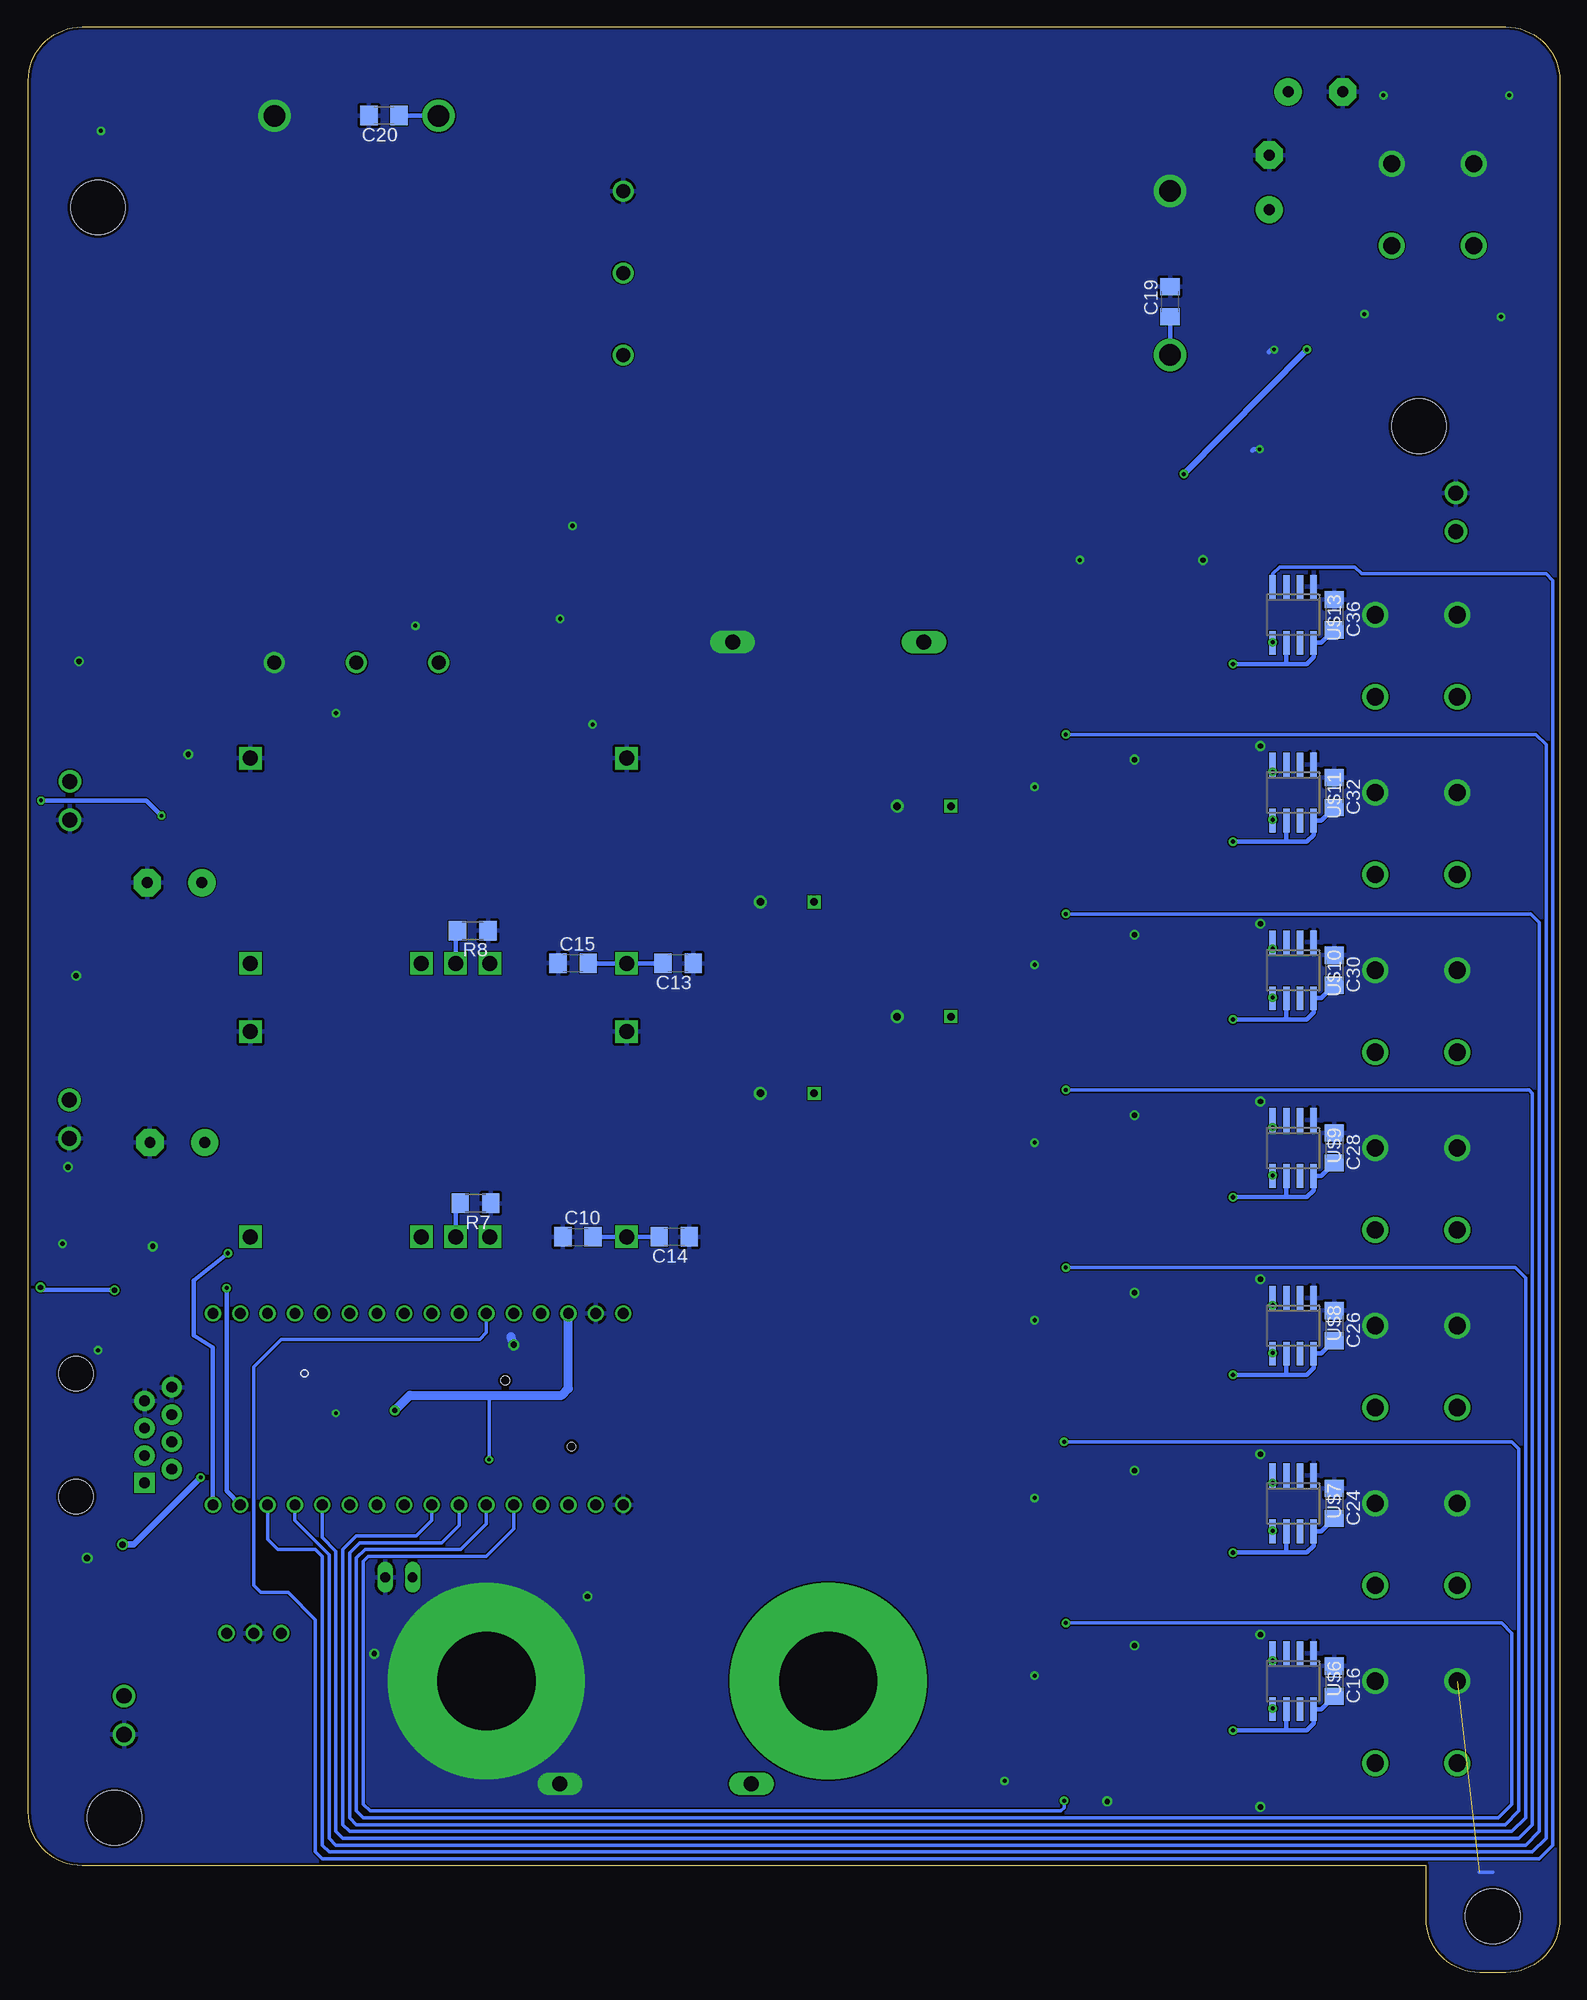
[diagram p7: board, bottom side, seen from below]

Size 142.24 x 180.75 mm. Coordinates in mm from the lower left corner, seen from the top.
Outline: 12.42,9.93 137.24,9.93 arc90 142.24,14.93 142.24,175.75 arc90 137.24,180.75 5,180.75 arc90 0,175.75 0,5 arc90 5,0 7.42,0 arc90 12.42,5 12.42,9.93
Copper layers (1*16): Top 0.035559375mm / dielectric 1.501140625mm / Bottom 0.035559375mm
Design rules "typical_4pcb *": minimum track width 5mil, minimum drill 10mil, track to track 5mil, track to pad 5mil, pad to pad 5mil, via to via 5mil, smd to smd 5mil, copper to edge 10mil, drill to drill 5mil, minimum pad ring 10mil, minimum via ring 8mil, stop-mask expansion 4mil, vias tented up to drill 0mil, thermal gap 10mil
Holes 5.08 mm at 13.08,143.66 135.76,163.98 134.24,14.38 6.22,5.23

### Footprints (pad centres in the part's own frame; a part is rotated, then mirrored left to right if it is on the bottom)
691322110002 = drill 1.4: L -1.79,0; R 1.79,0
20020618-M02 = drill 1.6: L1 -3.81,3.81; L2 -3.81,-3.81; R1 3.81,3.81; R2 3.81,-3.81
LARGE_TERMINAL_HOLE = drill 9.144 pad 18.288: P$1 0,0
C_12.5MM = drill 0.7 square: + -2.5,0 | drill 0.7: - 2.5,0
C1206 = smd 1.6 x 1.8: 1 -1.4,0; 2 1.4,0
E5-8,5 = drill 1.016 pad 2.54: + -2.54,0 | drill 1.016 pad 2.54 octagon: - 2.54,0
CB429-17 = drill 1.397 long: A 8.89,0; C -8.89,0
R_PDSS-T7 = drill 1.4 square: 1 -17.47,9.53; 2 -17.47,-9.52; 3 -4.77,-9.52; 4 -1.59,-9.52; 5 1.59,-9.52; 6 17.47,-9.52; 7 17.47,9.53
JP1 = drill 0.914 long: 1 0,-1.27; 2 0,1.27
L8530M = smd 2.4 x 1.4: 1 -3.7,0; 2 3.7,0
LED-1206 = smd 1.2 x 1.4: A -1.5,0; C 1.5,0
FKIT-LED-1206 = smd 1.6 x 1.803: A -1.422,0; C 1.422,0
OKI-78SRH = drill 1.016: 1 2.54,0; 2 0,0; 3 -2.54,0
U-T48-QB-NO_TRIM = drill 1.3: 1 -25.4,7.62; 2 -25.4,0; 3 -25.4,-7.62 | drill 2: 4 25.4,-7.62; 8 25.4,7.62
SOIC8_ACS711_SKETCH = smd 1.8 x 2.2: 1 -1.321,-2.6; 4 1.321,-2.6 | smd 0.6 x 2.2: 5 1.905,2.6; 8 -1.905,2.6 | smd 0.55 x 2.2: 6 0.686,2.6; 7 -0.686,2.6
SOT23-3 = smd 0.8 x 0.9: 1 -0.95,-1; 2 0.95,-1; 3 0,1.1
SOIC8_ACS711 = smd 1.92 x 2.2: 1 -1.27,-2.6; 4 1.27,-2.6 | smd 0.6 x 2.2: 5 1.905,2.6; 6 0.635,2.6; 7 -0.635,2.6; 8 -1.905,2.6
D2PACK = smd 1.6 x 3.5: 1 -2.54,-8.275; 2 2.54,-8.275 | smd 12.2 x 9.75: TAB 0,2
SOT323 = smd 0.7 x 0.7: 1 -0.65,-0.925; 2 0.65,-0.925; 3 0,0.925
SOT-223 = smd 1.2 x 2.2: 1 -2.3,-3.1; 2 0,-3.1; 3 2.3,-3.1 | smd 3.6 x 2.2: 4 0,3.1
1206 = smd 1.6 x 1.8: 1 -1.4,0; 2 1.4,0
R1206 = smd 1.6 x 1.803: 1 -1.422,0; 2 1.422,0
BUZZER-CCV = smd 3.2 x 2.5: + 4,0; - -4,0 | hole 0.8: -3.9,-2.25; 2.25,3.9
32U4_MCU_DIP = drill 1: 1 -8.89,19.05; 2 -8.89,16.51; 3 -8.89,13.97; 4 -8.89,11.43; 5 -8.89,8.89; 6 -8.89,6.35; 7 -8.89,3.81; 8 -8.89,1.27; 9 -8.89,-1.27; 10 -8.89,-3.81; 11 -8.89,-6.35; 12 -8.89,-8.89; 13 -8.89,-11.43; 14 -8.89,-13.97; 15 -8.89,-16.51; 16 -8.89,-19.05; 17 8.89,-19.05; 18 8.89,-16.51; 19 8.89,-13.97; 20 8.89,-11.43; 21 8.89,-8.89; 22 8.89,-6.35; 23 8.89,-3.81; 24 8.89,-1.27; 25 8.89,1.27; 26 8.89,3.81; 27 8.89,6.35; 28 8.89,8.89; 29 8.89,11.43; 30 8.89,13.97; 31 8.89,16.51; 32 8.89,19.05
SOD-323 = smd 0.63 x 0.83: 1 -1.115,0; 2 1.115,0
MAX3070E = smd 0.49 x 1.3: A -1.905,2.857; B -0.635,2.857; DI 0.635,-2.857; GND 1.905,-2.857; RO -0.635,-2.857; VCC -1.905,-2.857; Y 1.905,2.857; Z 0.635,2.857
RJ45-8 = drill 1 pad 1.88 square: 1 -4.445,6.35 | drill 1 pad 1.88: 2 -3.175,8.89; 3 -1.905,6.35; 4 -0.635,8.89; 5 0.635,6.35; 6 1.905,8.89; 7 3.175,6.35; 8 4.445,8.89 | hole 3.2: -5.715,0; 5.715,0
SO8 = smd 0.6 x 2.2: 1 -1.905,-2.6; 2 -0.635,-2.6; 3 0.635,-2.6; 4 1.905,-2.6; 5 1.905,2.6; 6 0.635,2.6; 7 -0.635,2.6; 8 -1.905,2.6

### Placement (x,y rotation side)
5V-EXT  H_WR-TBL_321*0002HORIZ  [691322110002]  138.38,108.86 90 top
5V-INT  H_WR-TBL_321*0002HORIZ  [691322110002]  133.35,23.9 90 top
12V-AUX  11.81,164.24 270 top
12V-CRIT  H_WR-TBL_321*0002HORIZ  [691322110002]  138.43,79.27 90 top
ARM_P  H_WR-TBL_321*0002HORIZ  [691322110002]  9.65,135.66 270 top
AUX_P  13.34,122.33 270 top
BATT-NEG  99.69,27.08 0 top
BATT-POS  67.94,27.08 0 top
C1  59.05,88.8 0 top
C2  71.75,99.47 0 top
C3  71.75,81.69 0 top
C4  59.05,108.36 0 top
C5  50.16,16.15 180 top
C6  24.77,152.54 180 top
C7  112.14,53.75 270 top
C8  136.91,73.18 0 top
C9  128.27,83.46 0 top
C10  91.19,68.35 0 bottom
C11  128.02,94.89 0 top
C12  130.65,114.58 180 top
C13  81.89,93.75 180 bottom
C14  82.25,68.35 180 bottom
C15  91.64,93.78 0 bottom
C16  20.96,27.08 270 bottom
C17  126.87,35.2 180 top
C18  138.56,36.22 90 top
C19  36.2,155.22 90 bottom
C20  109.2,172.5 180 bottom
C21  128.4,77.11 0 top
C22  128.65,101.24 0 top
C23  46.99,28.98 90 top
C24  20.96,43.59 270 bottom
C25  46.99,95.02 90 top
C26  20.96,60.1 270 bottom
C27  42.48,96.29 180 top
C28  20.96,76.61 270 bottom
C29  46.99,78.51 90 top
C30  20.96,93.12 270 bottom
C31  42.42,79.62 180 top
C32  20.96,109.63 270 bottom
C33  46.99,62 90 top
C34  22.86,139.55 180 top
C35  42.42,63.11 180 top
C36  20.96,126.14 270 bottom
C37  43.02,13.93 180 top
C38  42.39,30.25 180 top
C39  46.99,45.49 90 top
C40  42.42,46.6 180 top
C41  46.99,111.53 90 top
C42  42.48,112.64 180 top
C43  19.43,152.55 180 top
C44  41.27,131.22 0 top
C45  22.7,174.71 180 top
C46  26.99,166.3 90 top
C47  137.54,59.59 180 top
C48  139.06,64.41 90 top
C49  137.29,174.4 270 top
C50  133.73,174.4 270 top
C51  7.75,175.67 180 top
C52  13.34,175.67 0 top
D1  67.94,123.6 0 top
D2  83.98,17.55 0 top
DOOKU-12V-CRIT  104.14,77.88 0 top
JP1  107.82,36.73 270 top
L3  132.66,31.52 0 top
LED1  24.51,15.39 0 top
LED2  8.51,153.82 180 top
LED3  137.41,84.86 180 top
LED4  137.29,114.33 180 top
LED5  129.29,26.19 180 top
LED6  24.51,31.9 0 top
LED7  24.51,48.41 0 top
LED8  24.51,64.92 0 top
LED9  24.51,81.43 0 top
LED10  24.51,97.94 0 top
LED11  14.1,133.88 90 top
LED12  24.51,114.45 0 top
LED13  112.14,33.2 270 top
MOTOR_1  13.34,23.27 270 top
MOTOR_2  13.34,39.78 270 top
MOTOR_3  13.34,56.29 270 top
MOTOR_4  13.34,72.8 270 top
MOTOR_5  13.34,89.31 270 top
MOTOR_6  13.34,105.82 270 top
OKI-78SR-5/1.5-W36H  121.28,31.52 180 top
PALPATINE-12V  61.59,157.89 180 top
Q1  36.2,133.76 180 top
Q2  99.19,57.05 180 top
Q4  130.18,109.37 90 top
Q5  132.21,67.84 180 top
Q6  33.66,22 270 top
Q7  33.66,38.51 270 top
Q9  33.66,55.02 270 top
Q11  33.66,71.53 270 top
Q12  111.76,118.26 0 top
Q14  33.66,88.04 270 top
Q16  33.66,104.55 270 top
Q18  27.23,134.09 270 top
Q20  33.66,121.06 270 top
R1  104.78,57.52 270 top
R2  100.9,47.65 180 top
R3  87.55,38 270 top
R4  90.3,38 90 top
R5  122.94,56.29 270 top
R6  122.94,51.21 270 top
R7  100.71,71.46 180 bottom
R8  100.97,96.8 180 bottom
R9  20.96,16.66 270 top
R10  14.1,153.82 180 top
R11  137.67,88.93 90 top
R12  137.67,118.68 90 top
R13  129.16,22.12 0 top
R15  111.76,114.26 270 top
R16  20.96,33.17 270 top
R18  20.96,49.68 270 top
R20  20.96,66.19 270 top
R22  20.96,82.7 270 top
R24  20.96,99.21 270 top
R26  17.14,132.49 270 top
R28  20.96,115.72 270 top
SG1  94.04,52.76 180 top
SIDEOUS-12V  111.76,147.09 90 top
U$1  106.04,52.35 270 top
U$2  127.89,92.61 0 top
U$3  117.86,53.75 270 top
U$4  137.79,49.94 90 top
U$5  127.13,67.72 0 top
U$6  24.77,27.08 180 bottom
U$7  24.77,43.59 180 bottom
U$8  24.77,60.1 180 bottom
U$9  24.77,76.61 180 bottom
U$10  24.77,93.12 180 bottom
U$11  24.77,109.63 180 bottom
U$12  22.86,143.41 90 top
U$13  24.77,126.14 180 bottom
U$14  45.09,19.46 180 top
U$15  45.09,35.97 180 top
U$16  45.09,102.01 180 top
U$17  45.09,85.5 180 top
U$18  45.09,68.99 180 top
U$19  45.09,52.48 180 top
U$20  45.09,118.52 180 top
U$21  20.96,157.89 180 top
U$22  107.06,110.13 0 top
VADER-5V-EXT  104.14,103.28 0 top

### Tracks (layer width: path | path; a pad name or v marks a point on that pad's centre or on a via)
5V-EXT
  Top 0.406: LED4.A 138.79,111.06 5V-EXT.R | C12.1 132.05,111.37 Q4.4
  Top 1.27: Q4.4 132.79,110.65 5V-EXT.R
5V-IMEAS  (via drill 0.38)
  Top 0.406: v123.7,66.83 97.79,66.83 97.03,67.59 96.01,67.59 95.79,67.81 95.79,99.69 96.33,100.23 115.28,100.23 118.49,103.44 118.49,107.85 119.38,108.74 Q4.7
  Bottom 0.406: U$1.32 125.09,58.06 126.87,59.21 126.87,64.29 v123.7,66.83
12V-AUX
  Top 0.406: R10.1 15.88,153.57 15.88,156.11
  pour Top (rank 2, no thermals): 20.7,161.95 20.7,158.9 17.14,155.35 6.99,155.35 5.71,156.62 5.71,164.24 6.99,165.51 17.14,165.51
12V-CRIT
  Top 0.406: C8.1 135.38,73.3 133.48,73.3 | LED3.A 138.91,81.55 12V-CRIT.R
  Top 1.016: OKI-78SR-5/1.5-W36H.1 118.75,36.6 120.01,37.87 128.91,37.87 133.98,42.95 133.98,61.24 137.16,64.41 137.16,68.86 135.58,70.44 Q5.1
  Top 1.27: Q5.1 133.48,73.3 133.48,78.89 135.65,81.06 12V-CRIT.R
12V-IMEAS  (via drill 0.38)
  Top 0.406: v123.82,63.59 123.82,65.18 122.87,66.13 97.47,66.13 96.8,66.8 95.28,66.8 94.93,67.15 94.93,100.1 95.88,101.05 114.9,101.05 117.6,103.75 117.6,161.54 115.54,163.6 87.5,163.6 86.36,163.6 85.88,163.6 66.99,144.71 33.97,144.71 27.62,151.06 27.62,154.08 27.3,154.39 26.04,154.39 23.18,157.25 22.07,157.25 21.59,156.78 U$21.7
  Bottom 0.406: U$1.31 123.82,44.73 v123.82,63.59
12V-SIG
  Top 0.406: R15.2 111.74,113.13 111.74,111.4 93.47,111.4 91.19,109.12 91.19,64.82 91.97,64.03 95,64.03 97.16,61.87 U$1.12
+5V  (via drill 0.33, 0.38, 0.5, 0.6)
  Top 0.254: 45.09,63.65 45.09,48.03 45.09,35.17 | 45.09,63.65 45.09,78.51 | 45.09,97.43 45.09,80.92 46.99,80.92 | 45.09,97.43 45.09,113.94 | 45.09,113.94 45.09,127.41 43.94,128.55 39.12,128.55 38.1,129.57 38.1,130.45 | 46.99,63.65 45.09,63.65 | 46.99,97.43 45.09,97.43 | 46.99,113.94 45.09,113.94 | 36.2,134.77 36.2,137.95
  Top 0.279: C7.1 112.91,55.15 113.41,55.65 U$3.VCC | 45.09,78.51 45.09,80.92
  Top 0.305: 46.99,16.15 C5.2 | U$19.8 46.99,48.03 45.09,48.03 | C29.2 46.99,80.92 | C25.2 46.99,97.43 | U$20.8 46.99,113.94 | C23.2 46.99,31.39 45.09,31.39 45.09,18.95 45.47,18.57 46.35,18.57 46.99,17.93 | 38.1,130.45 Q1.8 38.1,131.98 | 23.5,152.04 C6.2 | 45.09,35.17 46.99,35.17 U$15.8 | 99.69,47.84 R2.2 v99.44,47.65
  Top 0.406: C23.2 U$15.8 | U$19.8 C39.2 | U$18.8 46.99,63.65 C33.2 | U$17.8 C29.2 | U$16.8 C25.2 | U$20.8 C41.2 | U$21.8 22.86,152.68 C6.2 | Q1.8 39.81,131.16 C44.1 | 5V-INT.R 132.83,25.69 132.33,26.19 LED5.A | C7.1 111.13,55.15 v108.2,52.22 | 36.2,137.95 v34.92,139.22 | v23.5,150.77 23.5,152.04 | 38.1,131.98 38.1,133.12 37.47,133.76 36.2,133.76 36.2,134.77 | 46.99,17.93 U$14.8 46.99,16.15 46.99,16.03 | C18.1 138.56,32.66 137.54,31.65 136.48,31.65 L3.2 | Q4.8 v129.87,107.47 | C47.1 141.1,59.59 | C48.1 141.1,63.01 141.1,62.89 | C49.1 137.29,178.21 | C50.1 133.98,175.8 133.98,178.21 | C52.1 C51.1 10.54,175.67 10.54,178.21 | Q5.8 134.11,63.53 v134.24,63.4 | 14.1,150.77 13.84,150.77
  Top 0.813: v126.24,46 110.01,46 108.2,47.68 v108.2,52.22 | L3.2 136.27,31.44 136.27,27.33 134.75,25.81 133.48,25.81 133.47,25.81 5V-INT.R | SG1.+ 91.34,52.76 92.2,53.87 92.2,61.11 U$1.14
  Top 1.016: 14.1,150.77 v23.5,150.77
  Top 1.27: 133.48,25.81 v133.48,39.78 134.75,41.05 140.59,41.05 141.1,41.55 141.1,59.59 141.1,62.89 v141.1,63.65 141.1,108.84 | 141.1,108.84 v141.05,108.89 | 141.1,108.84 141.1,175.41 138.3,178.21 137.29,178.21 133.98,178.21 10.54,178.21 5.46,178.21 3.18,175.92 3.18,153.31 5.74,150.77 13.84,150.77
  Bottom 0.305: 106.81,53.62 99.82,53.62 99.44,53.24 v99.44,47.65
  Bottom 0.406: v141.05,108.89 141.1,108.89 141.1,108.86 131.27,108.86 v129.87,107.47 | v134.24,63.4 140.84,63.4 v141.1,63.65
  Bottom 0.61: v34.92,139.22 v23.5,150.77 | v126.24,46 132.46,39.78 v133.48,39.78
  Bottom 0.813: v108.2,52.22 106.81,53.62 92.71,53.62 92.07,54.25 U$1.14 | 133.48,25.81 133.47,25.81 5V-INT.R
ARM_P-IMEAS
  Top 0.406: Q1.7 36.83,129.95 36.2,129.31 6.99,129.31 5.71,130.58 5.71,146.3 6.67,147.25 26.99,147.25 32.7,141.54 69.06,141.54 83.66,156.14 88.58,156.14 89.53,157.09 108.9,157.09 110.97,155.03 110.97,123.12 110.01,122.17 110.01,114.23 107.95,112.17 93.03,112.17 90.33,109.47 90.3,64.67 91.59,63.37 94.35,63.37 95.88,61.84 95.88,46.13 94.62,44.86 U$1.20
ARM_P-SIG
  Top 0.406: U$1.13 94.62,61.87 93.85,62.64 91.31,62.64 89.53,64.41 89.53,109.79 92.71,112.96 107.63,112.96 109.22,114.55 109.22,122.49 110.17,123.44 110.17,154.71 108.59,156.3 89.85,156.3 88.9,155.35 83.98,155.35 69.37,140.74 32.26,140.74 27.69,145.31 U$12.4
AUX_P-IMEAS  (via drill 0.38)
  Top 0.305: U$20.7 45.88,115.76 v45.88,115.02
  Bottom 0.305: v45.88,115.02 2.22,115.02 1.27,114.07 1.27,12.47 2.54,11.2 114.3,11.2 114.94,11.84 114.94,38.67 115.57,39.3 119.06,39.3 120.01,40.25 U$1.30
AUX_P-SIG
  Bottom 0.305: U$13.4 26.67,129.95 26.04,130.58 19.05,130.58 18.41,129.95 1.27,129.95 0.64,129.31 0.64,11.84 1.91,10.57 114.94,10.57 115.57,11.2 115.57,32.79 118.11,35.33 120.65,35.33 121.28,35.97 121.28,56.29 118.75,58.83 100.33,58.83 99.69,59.46 U$1.11
BUZZ_BUZZ_MOTHERFUCKER
  Top 0.305: U$1.8 107.31,58.57 106.3,57.56 101.73,57.56 101.22,58.06 100.15,58.06 Q2.1
CRIT-IMEAS
  Top 0.406: U$1.1 126.52,62.64 131.44,62.64 132.84,64.03 Q5.7
GND  (via drill 0.33, 0.38, 0.5, 0.6)  (1 unrouted)
  Top 0.305: C25.1 v48.77,93.62 | v48.77,77.11 C29.1 | C33.1 v48.77,60.6 | C39.1 v48.77,44.09 | C23.1 v48.77,27.58 | C41.1 v48.77,110.13 | C44.2 v44.58,131.22 | LED13.C 112.14,30.38 111.38,29.62 v110.11,29.62
  Top 0.406: v51.56,17.81 C5.1 | U$14.5 42.99,16.86 v42.04,15.9 42.04,14.35 C37.2 | v39.5,30.38 40.86,30.38 C38.2 40.99,31.17 U$15.5 | v39.5,46.63 40.99,46.63 C40.2 41.02,47.71 U$19.5 | U$18.5 41.02,64.22 C35.2 40.99,63.14 v39.5,63.14 | v39.5,79.65 40.99,79.65 C31.2 41.02,80.73 U$17.5 | v39.5,96.42 40.95,96.42 C27.2 41.08,97.31 U$16.5 | U$20.5 41.08,113.82 C42.2 41.05,112.67 v39.5,112.67 | Q1.5 33.21,131.16 v33.15,131.22 | LED2.C v5.46,153.82 | OKI-78SR-5/1.5-W36H.2 121.28,33.68 122.81,35.2 C17.2 | v90.3,34.95 R4.1 | U$3.GND 113.79,51.84 v113.66,51.97 112.52,51.97 C7.2 | ARM_P.L 10.4,137.45 12.32,135.53 13.95,135.53 LED11.C | R13.2 130.57,22.11 5V-INT.L | Q12.2 112.75,116.99 v113.66,116.99 | Q5.5 130.3,67.08 v130.68,67.46 130.43,67.72 U$5.2 | C18.2 137.67,38.51 v136.78,38.51 | v138.56,74.83 138.31,75.08 C8.2 | C9.2 130.94,82.2 C21.- | C22.- 131.19,96.67 C11.2 129,94.48 U$2.2 | v137.79,92.61 137.79,90.45 R11.2 | C47.2 135.76,59.59 v135.76,57.81 | C48.2 v139.06,67.72 | R12.2 137.67,121.69 v137.54,121.82 | C12.2 127.85,113.18 v127.38,113.18 127.38,111.47 Q4.5 | C50.2 133.73,172.87 v135.51,171.09 135.51,171.22 C49.2 | v16.38,174.4 16.38,175.16 15.88,175.67 C52.2 | v4.7,174.4 4.7,175.16 5.21,175.67 C51.2 | LED7.C 27.56,48.41 v27.81,48.16 | LED8.C 27.3,64.92 v27.81,64.41 | LED9.C 27.3,81.43 v27.81,80.92 | LED10.C 27.3,97.94 v27.81,97.43 | LED12.C 27.3,114.45 v27.81,113.94 | LED1.C v27.81,15.39 | LED6.C 27.3,31.9 v27.81,31.39 | C6.1 26.16,151.15 v26.54,150.77 | U$21.5 19.05,154.97 v18.16,154.08 18.03,153.82 C43.2 | v27.89,141.5 U$12.1 24.13,140.18 C34.1
  Top 0.813: Q2.2 97.47,58 v97.16,58.32
  Bottom 0.305: 6.22,9.3 7.49,9.3
  Bottom 0.406: v26.54,150.77 26.8,150.77 27.05,150.52 | v27.89,141.5 28.45,141.5 28.57,141.38
  Bottom 0.813: v97.16,58.32 97.41,59.08
  other vias: 106.3,125.12 89.82,115.94 92.84,125.76 91.69,134.39
  pour Bottom (rank 2): -0.63,8.03 158.11,8.03 158.11,185.83 -0.63,185.83
  pour Bottom (no thermals): 31.62,169.82 41.78,169.82 41.78,161.44 31.62,161.44
  pour Bottom (no thermals): 114.94,175.92 125.09,175.92 125.09,167.54 114.94,167.54
  pour Bottom (no thermals): 114.68,126.9 124.84,126.9 124.84,118.52 114.68,118.52
  pour Bottom (no thermals): 6.48,170.84 18.67,170.84 18.67,165.76 6.48,165.76
  pour Bottom (no thermals): 6.73,128.42 18.92,128.42 18.92,123.34 6.73,123.34
  pour Bottom (no thermals): 6.73,112.67 18.92,112.67 18.92,107.59 6.73,107.59
  pour Bottom (no thermals): 6.99,95.91 19.18,95.91 19.18,90.83 6.99,90.83
  pour Bottom (no thermals): 6.99,79.4 19.18,79.4 19.18,74.32 6.99,74.32
  pour Bottom (no thermals): 6.99,79.4 19.18,79.4 19.18,74.32 6.99,74.32
  pour Bottom (no thermals): 6.48,62.64 18.67,62.64 18.67,57.56 6.48,57.56
  pour Bottom (no thermals): 6.48,62.64 18.67,62.64 18.67,57.56 6.48,57.56
  pour Bottom (no thermals): 7.24,46.13 19.43,46.13 19.43,41.05 7.24,41.05
  pour Bottom (no thermals): 7.24,29.62 19.43,29.62 19.43,24.54 7.24,24.54
  pour Bottom (no thermals): 72.77,127.66 82.93,127.66 82.93,119.28 72.77,119.28
  pour Bottom (no thermals): 88.52,24.03 98.68,24.03 98.68,15.65 88.52,15.65
  pour Bottom (no thermals): 59.56,111.4 79.12,111.4 79.12,75.84 59.56,75.84
  pour Bottom: -1.9,12.09 13.84,12.09 13.84,-0.86 -1.9,-0.86
INFO_LED
  Top 0.305: U$1.9 R1.1
JUMPER_SIG_IN
  Top 0.305: JP1.1 104.78,36.73 103.5,38 103.5,45.11 102.49,46.13 102.49,47.46 R2.1 102.3,54.44 99.19,57.56 99.19,59.08 99.44,59.33 101.47,59.33 102.24,60.1 U$1.10
M1-IMEAS  (via drill 0.38)
  Top 0.305: 45.72,16.28 v46.04,15.96
  Top 0.406: U$14.7 45.72,16.28
  Bottom 0.305: v46.04,15.96 46.04,15.33 46.35,15.01 110.49,15.01 111.12,15.65 111.12,38.19 110.65,38.67 99.69,38.67 97.16,41.21 U$1.21
M1-SIG  (via drill 0.38)
  Top 0.305: 26.7,28.98 v26.67,28.98 2.54,28.98 1.91,28.35 1.91,13.11 3.18,11.84 113.66,11.84 114.3,12.47 114.3,36.44 111.28,39.46 108.9,41.87 U$1.25
  Bottom 0.305: U$6.4 v26.67,28.98
M2-IMEAS  (via drill 0.38)
  Top 0.406: U$15.7 45.72,32.63 v45.88,32.47
  Bottom 0.305: v45.88,32.47 5.4,32.47 4.45,31.52 4.45,15.65 5.71,14.38 111.12,14.38 111.76,15.01 111.76,38.51 110.97,39.3 102.08,39.3 99.69,41.68 U$1.22
M2-SIG  (via drill 0.38)
  Top 0.305: v26.67,45.49 1.91,45.49 1.27,44.86 1.27,12.47 2.54,11.2 114.3,11.2 114.94,11.84 114.94,38.35 109.85,43.43 U$1.26
  Bottom 0.305: U$7.4 v26.67,45.49
M3-IMEAS  (via drill 0.38)
  Top 0.305: v46.04,49.3 46.04,49.56 U$19.7
  Bottom 0.305: v46.04,49.3 4.45,49.3 3.81,48.67 3.81,15.01 5.08,13.74 111.76,13.74 112.4,14.38 112.4,38.98 111.44,39.94 103.82,39.94 102.24,41.52 U$1.23
M3-SIG  (via drill 0.38)
  Top 0.305: v26.67,62 1.27,62 0.64,61.37 0.64,11.84 1.91,10.57 114.94,10.57 115.57,11.2 115.57,40.25 112.4,43.43 U$1.27
  Bottom 0.305: U$8.4 v26.67,62
M4-IMEAS  (via drill 0.38)
  Top 0.305: U$18.7 45.88,66.23 v45.88,65.49
  Bottom 0.305: v45.88,65.49 4.13,65.49 3.18,64.54 3.18,14.38 4.45,13.11 112.4,13.11 113.03,13.74 113.03,39.3 111.76,40.57 106.2,40.57 104.78,42 U$1.24
M4-SIG  (via drill 0.38)
  Top 0.406: v26.67,78.51 4.6,78.51 3.33,79.78 3.33,147.25 5.71,149.63 27.94,149.63 33.66,143.92 67.63,143.92 86.52,162.81 86.68,162.81 87.5,162.81 115.06,162.81 116.81,161.06 116.81,104.07 114.59,101.85 95.57,101.85 93.98,100.26 93.98,66.57 94.36,66.19 96.14,66.19 97.16,65.18 122.24,65.18 122.56,64.86 U$1.2
  Bottom 0.406: v26.67,78.51 U$9.4
M5-IMEAS  (via drill 0.38)
  Top 0.305: v45.88,82 45.88,82.74 U$17.7
  Bottom 0.305: v45.88,82 2.86,82 2.54,81.69 2.54,13.74 3.81,12.47 113.03,12.47 113.66,13.11 113.66,39.14 114.94,40.41 U$1.28
M5-SIG  (via drill 0.38)
  Top 0.406: v26.67,95.12 26.66,95.02 4.76,95.02 4.13,95.66 4.13,146.93 6.03,148.84 27.62,148.84 33.34,143.12 68.1,143.12 87,162.01 114.74,162.01 116.01,160.74 116.01,104.39 114.27,102.64 95.25,102.64 93.03,100.42 93.03,65.75 93.34,65.43 95.82,65.43 96.87,64.38 114.3,64.38 114.94,63.75 U$1.5
  Bottom 0.406: U$10.4 v26.67,95.12
M6-IMEAS  (via drill 0.38)
  Top 0.305: 45.88,98.51 U$16.7 45.88,99.25 v45.88,98.36
  Bottom 0.305: v45.88,98.36 2.7,98.36 1.91,97.56 1.91,13.11 3.18,11.84 113.66,11.84 114.3,12.47 114.3,38.82 117.47,42 U$1.29
M6-SIG  (via drill 0.38)
  Top 0.406: v26.67,111.53 5.97,111.53 4.92,112.58 4.92,146.62 6.35,148.04 27.3,148.04 33.02,142.33 68.58,142.33 87.47,161.22 114.27,161.22 115.22,160.27 115.22,104.71 113.95,103.44 94.77,103.44 92.07,100.74 92.07,65.43 92.74,64.76 95.38,64.76 96.55,63.59 111.76,63.59 112.4,62.95 U$1.6
  Bottom 0.406: U$11.4 v26.67,111.53
N$1
  Top 0.406: U$14.6 44.45,15.14 C37.1
N$2
  Top 0.406: C38.1 44.4,30.86 U$15.6
N$3
  Top 0.406: R11.1 137.67,86.62 LED3.C
N$4
  Top 0.406: Q12.3 SIDEOUS-12V.2 111.76,155.44 109.31,157.89 PALPATINE-12V.2
N$5
  Top 0.406: R12.1 137.67,116.21 LED4.C
N$6
  Top 0.406: LED5.C 127.63,26.04 127.63,21.49 127.76,21.61 R13.1
N$7
  Top 0.406: 104.14,172.65 SIDEOUS-12V.8
  Top 7.62: 78.1,172.49 SIDEOUS-12V.8
  Bottom 0.406: C19.1 PALPATINE-12V.8 | SIDEOUS-12V.8 107.06,172.49 | 107.06,172.49 108.2,172.49 108.33,172.62 | C20.1 107.07,172.5 107.06,172.49
  pour Top (no thermals): 21.21,161.7 21.21,158.9 34.92,145.19 66.67,145.19 83.19,161.7 83.19,175.67 81.91,176.94 23.5,176.94 22.23,175.67 22.23,162.71
N$8
  Top 0.813: Q2.3 99.19,52.38 SG1.-
N$9
  Bottom 0.406: R7.2 102.55,71.05 DOOKU-12V-CRIT.4
N$11
  Top 0.305: LED13.A 112.14,37.49 109.09,40.54 106.81,40.54 106.04,41.3 106.04,47.4 104.78,48.67 R1.2
N$12
  Top 0.406: U$21.6 20.32,153.06 C43.1
N$14
  Top 0.305: U$3.Y 120.71,50.89 121.67,49.94 122.81,49.94 R6.2 124.75,49.81 126.68,47.87 126.68,46.76 128.27,45.17 131.13,45.17 U$4.1
N$16
  Top 0.305: VADER-5V-EXT.6 VADER-5V-EXT.5
  Top 0.406: C11.1 126.62,97.44 125.98,98.07 | U$2.1 125.1,92.61 122.79,94.92
  Top 1.27: VADER-5V-EXT.6 122.79,94.92 125.74,97.82 125.98,98.07 126.11,98.2 C22.+ 126.11,102.77 127.63,104.29 131.7,104.29 132.72,105.31 132.72,108.04 Q4.1
N$17
  Top 0.406: C27.1 44.4,97.06 U$16.6
N$18
  Top 0.305: U$3.Z 122.43,53.11 R6.1 123.06,52.61 U$4.2
N$19
  Top 0.305: U$3.B 122.43,54.38 R5.2 125.98,51.84 U$4.6
N$20
  Top 0.305: U$3.A 120.71,56.6 121.67,57.56 122.81,57.56 R5.1 130.52,57.69 132.87,55.33 132.87,49.46 U$4.3
N$21
  Top 0.305: U$3.DI 118.49,53.11 119.13,53.75 119.13,57.81 120.01,58.7 U$1.3
N$22
  Top 0.406: C31.1 44.4,80.2 U$17.6
N$23
  Top 0.406: C35.1 44.4,63.69 U$18.6
N$24
  Top 0.406: C40.1 44.4,47.18 U$19.6
N$25
  Top 0.406: C42.1 44.4,113.41 U$20.6
N$28  (via drill 0.38)
  Bottom 0.406: v30.35,39.01 25.4,39.01 | 25.4,39.01 23.5,39.01 22.86,39.65 U$7.8 22.16,40.99 C24.2 | U$7.6 25.4,39.01
  pour Top (rank 2, no thermals): 29.84,44.6 41.02,44.6 44.51,40.79 44.51,36.22 40.77,32.16 29.84,32.16
N$29
  pour Top (no thermals): 8.26,34.95 8.26,36.98 9.78,38.51 26.54,38.51 28.07,36.98 28.07,34.95 26.54,33.43 9.78,33.43
N$30  (via drill 0.38)
  Top 0.406: Q7.1 v26.67,41.05
  Bottom 0.406: v26.67,41.05 U$7.5
N$31
  Top 0.406: R16.2 22.88,31.77 LED6.A
N$35
  Bottom 0.406: R8.2 102.55,96.64 VADER-5V-EXT.4
N$36
  Top 0.406: DOOKU-12V-CRIT.5 DOOKU-12V-CRIT.6 | 125.86,70.69 128.14,70.44 | U$5.1 125.09,67.72 124.08,68.73 | C21.+ 125.86,82.45 C9.1
  Top 1.27: DOOKU-12V-CRIT.6 123.7,68.36 124.08,68.73 125.79,70.44 128.14,70.44 Q5.4 | C21.+ 125.86,70.69
N$39
  Top 0.406: R9.2 22.88,15.26 LED1.A
N$40  (via drill 0.38)
  Bottom 0.406: v30.35,22.5 25.53,22.5 | 25.53,22.5 23.5,22.5 22.86,23.14 U$6.8 22.16,24.48 C16.2 | U$6.6 25.4,22.63 25.53,22.5
  pour Top (rank 3, no thermals): 29.84,28.35 41.02,28.35 44.83,24.54 44.83,19.96 40.77,15.9 29.84,15.9
N$41
  pour Top (no thermals): 8.26,18.44 8.26,20.47 9.78,22 26.54,22 28.07,20.47 28.07,18.44 26.54,16.92 9.78,16.92
N$42  (via drill 0.38)
  Top 0.406: Q6.1 v26.67,24.54
  Bottom 0.406: U$6.5 v26.67,24.54
N$44  (via drill 0.38)
  Bottom 0.406: v30.35,55.52 25.4,55.52 | 25.4,55.52 23.5,55.52 22.86,56.16 U$8.8 22.16,57.5 C26.2 | U$8.6 25.4,55.52
  pour Top (rank 3, no thermals): 29.84,61.11 41.02,61.11 44.83,57.3 44.83,52.73 40.77,48.67 29.84,48.67
N$45
  pour Top (no thermals): 8.26,51.46 8.26,53.49 9.78,55.02 26.54,55.02 28.07,53.49 28.07,51.46 26.54,49.94 9.78,49.94
N$46
  Top 0.406: LED2.A R10.2
N$47  (via drill 0.38)
  Top 0.406: Q9.1 v26.67,57.56
  Bottom 0.406: U$8.5 v26.67,57.56
N$49
  Top 0.406: R18.2 22.88,48.28 LED7.A
N$54  (via drill 0.38)
  Bottom 0.406: v30.35,72.03 25.4,72.03 | 25.4,72.03 23.5,72.03 22.86,72.67 U$9.8 22.16,74.01 C28.2 | U$9.6 25.4,72.03
  pour Top (rank 3, no thermals): 29.84,77.62 41.02,77.62 44.83,73.81 44.83,69.24 40.77,65.18 29.84,65.18
N$55
  pour Top (no thermals): 8.26,67.97 8.26,70 9.78,71.53 26.54,71.53 28.07,70 28.07,67.97 26.54,66.45 9.78,66.45
N$56  (via drill 0.38)
  Top 0.406: Q11.1 v26.67,74.07
  Bottom 0.406: U$9.5 v26.67,74.07
N$57
  Top 0.406: R20.2 22.88,64.79 LED8.A
N$60  (via drill 0.38)
  Bottom 0.406: v30.35,88.54 25.53,88.54 | 25.53,88.54 23.5,88.54 22.86,89.18 U$10.8 22.16,90.52 C30.2 | U$10.6 25.4,88.67 25.53,88.54
  pour Top (rank 3, no thermals): 29.84,94.13 41.02,94.13 44.83,90.32 44.83,85.75 40.77,81.69 29.84,81.69
N$61
  pour Top (no thermals): 8.26,84.48 8.26,86.51 9.78,88.04 26.54,88.04 28.07,86.51 28.07,84.48 26.54,82.96 9.78,82.96
N$62  (via drill 0.38)
  Top 0.406: Q14.1 v26.67,90.58
  Bottom 0.406: U$10.5 v26.67,90.58
N$63
  Top 0.406: R22.2 22.88,81.3 LED9.A
N$66  (via drill 0.38)
  Bottom 0.406: v30.35,105.05 25.27,105.05 | 25.27,105.05 23.5,105.05 22.86,105.69 U$11.8 22.16,107.03 C32.2 | U$11.6 25.4,105.18 25.27,105.05
  pour Top (rank 3, no thermals): 29.84,110.64 41.12,110.64 44.83,106.86 44.83,102.26 40.77,98.2 29.84,98.2
N$67
  pour Top (no thermals): 8.26,100.99 8.26,103.02 9.78,104.55 26.54,104.55 28.07,103.02 28.07,100.99 26.54,99.47 9.78,99.47
N$68  (via drill 0.38)
  Top 0.406: Q16.1 v26.67,107.09
  Bottom 0.406: U$11.5 v26.67,107.09
N$69
  Top 0.406: R24.2 22.88,97.81 LED10.A
N$72
  Top 0.406: U$12.6 18.8,144.04 18.41,143.66 18.41,141.88 18.8,141.5 U$12.8 21.59,140.18 C34.2 21.46,139.8 21.46,135.03 22.4,134.09 Q18.2
  Top 1.27: Q18.2 Q18.4 32.6,136.36 Q1.4
N$73
  Top 1.27: ARM_P.R 10.14,133.89 R26.1 19.3,133.89 21.4,131.79 Q18.3
N$74
  Top 0.406: Q18.1 23.15,136.39 22.86,136.68 22.86,144.3 21.84,145.31 U$12.5
N$75
  Top 0.406: LED11.A 14.1,131.09 R26.2
N$78  (via drill 0.38)
  Bottom 0.406: v30.35,121.56 25.53,121.56 | 25.53,121.56 23.5,121.56 22.86,122.2 U$13.8 22.16,123.54 C36.2 | U$13.6 25.4,121.69 25.53,121.56
  pour Top (rank 3, no thermals): 29.84,127.15 41.02,127.15 44.83,123.34 44.83,118.77 40.77,114.71 29.84,114.71
N$79
  pour Top (no thermals): 8.26,117.5 8.26,119.53 9.78,121.06 26.54,121.06 28.07,119.53 28.07,117.5 26.54,115.98 9.78,115.98
N$80  (via drill 0.38)
  Top 0.406: Q20.1 v26.67,123.6
  Bottom 0.406: U$13.5 v26.67,123.6
N$81
  Top 0.406: R28.2 22.88,114.32 LED12.A
N$100
  Top 0.406: 127.96,34.5 C17.1 128.96,34.52 L3.1
  Top 1.016: OKI-78SR-5/1.5-W36H.3 L3.1
N$114
  Top 0.305: R15.1 111.25,115.98 111.25,117.27 Q12.1
PRIMARY-VMEAS
  Top 0.406: R3.1 R4.2 90.3,39.88 92.07,41.68 U$1.19
RXD
  Top 0.305: U$3.RO 117.22,54.38 118.36,55.52 118.36,57.81 117.47,58.7 U$1.4
V_BATT
  Top 0.406: R3.2 87.45,36.47 84.46,36.47 84.2,36.73
  Top 1.27: Q1.1 48.84,136.36 51.44,133.76
  Bottom 0.406: C13.2 VADER-5V-EXT.2 90.22,93.76 C15.2 | C10.2 DOOKU-12V-CRIT.2 C14.2
  pour Top (rank 2, no thermals): 45.09,124.87 45.09,118.52 50.16,118.52 50.16,108.36 45.09,108.36 45.09,102.01 50.16,102.01 50.16,91.85 45.09,91.85 45.09,85.5 50.16,85.5 50.16,75.34 45.09,75.34 45.09,68.99 50.16,68.99 50.16,58.83 45.09,58.83 45.09,52.48 50.16,52.48 50.16,42.32 45.4,42.32 45.4,35.97 50.16,35.97 50.16,25.81 45.09,25.81 45.09,19.46 50.16,19.46 55.34,12.34 85.72,12.31 85.72,117.25 86.36,117.25 86.36,135.03 50.16,135.03 50.16,124.87
  pour Top (no thermals): 83.38,132.49 89.53,132.49 89.53,151.03 88.26,152.3 85.72,152.3 84.46,151.03 84.46,136.3 83.38,135.03
  pour Top (no thermals): 89.53,127.09 89.53,133.44 85.72,132.49 85.72,117.25 85.57,115.98 88.11,118.52 104.65,118.52 106.04,119.91 106.04,123.6 104.78,124.87 92.07,124.87 92.07,124.95
  pour Top: 85.22,95.66 88.52,95.66 88.52,91.85 85.22,91.85
  pour Top: 84.96,70.26 88.26,70.26 88.26,66.45 84.96,66.45

### Text on the board
Top: HORIZON / 2015 | Missouri S&T Mars Rover Design Team | ROVE DOWN FOR WHAT
tStop: Jake Armenta | HORIZON / 2015 | Missouri S&T Mars Rover Design Team